# Altium project PLD.PrjPcb (part 1 of 2)
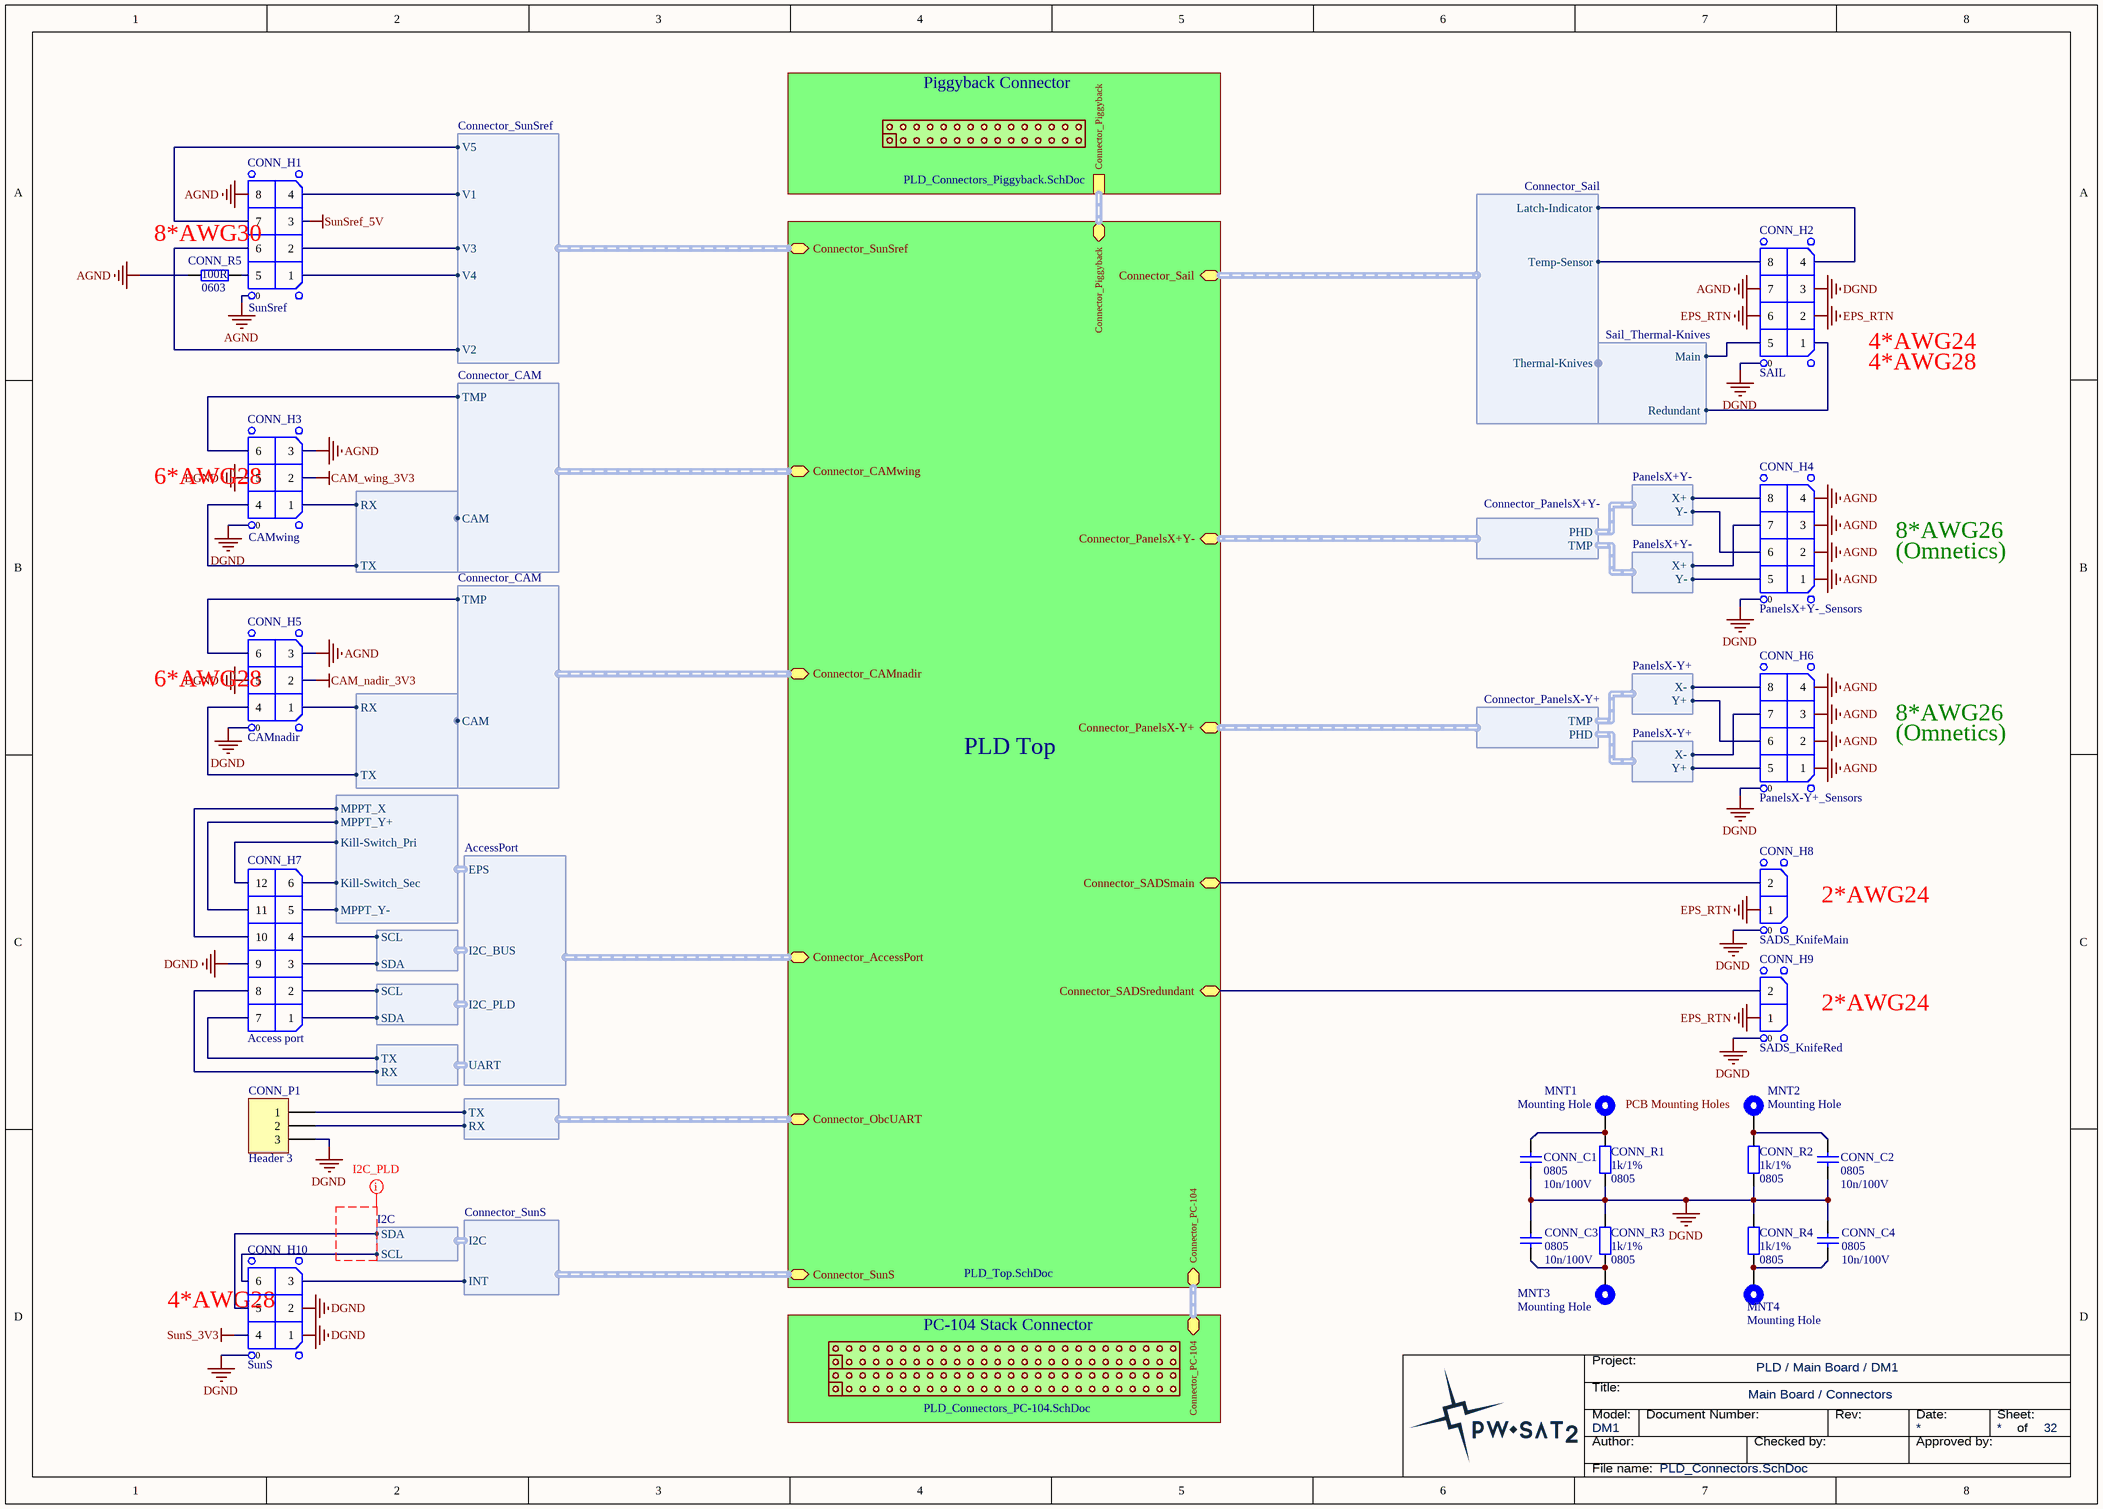
[diagram p0: PLD_Connectors.SchDoc]
ApprovedBy_Name: Piotr Kuligowski; Author_Name: Grzegorz Gajoch; CheckedBy_Name: Michal Gumiela; Equipment: Main Board; Model: DM1; PCB_Author: (pcbdoc author); PCB_CheckedBy: (not checked); PCB_DocName: Main Board; PCB_DocNo: PWSat2-xxx-DW-xxx; PCB_Id: Main Board; PCB_Revision: 1; Project_FullName: PW-Sat2; Project_Id: PLD; Project_ShortName: PLD; Schematics_DocName: Main Board; Schematics_DocNo: PWSat2-xxx-DW-xxx; Schematics_Revision: 1; Subsystem: PLD
22 sheets, 195 parts. Net scope: hierarchical (ports join the sheet entries above them; power ports are global).
Board file: PLD.PcbDoc
Sheets:
  PLD_Connectors.SchDoc
    PLD Top = PLD_Top.SchDoc
      RadFET = PLD_RadFET.SchDoc
        Radfet Supply = PLD_RadFET_Supply.SchDoc
          LCL 5V = PLD_RadFET_LCL.SchDoc
          LCL 3V3d = PLD_RadFET_LCL.SchDoc
        Current source = PLD_RadFET_Current_Source.SchDoc
        Channel selector = PLD_RadFET_Mux.SchDoc
        Filter = PLD_RadFET_Differential_Lowpass.SchDoc
      AVR interface = PLD_Sensors_AVR_Interface.SchDoc
        Watchdog = PLD_AVR_Watchdog.SchDoc
      UART-Buffer&MUX for CAMs = PLD_CAM_MUX.SchDoc
      SunS Ref. Interface = PLD_SunSref-Interface.SchDoc
      ADC = PLD_ADC.SchDoc
      Gyroscopes = PLD_Gyroscopes.SchDoc
      Flash Memory 3 = PLD_Flash-Memory.SchDoc
      8 CH PT1000 interface = PLD_Thermometers_PT1000.SchDoc
        PT1000 interface = PLD_Thermometers_PT1000_interface.SchDoc
      ADC MUX = PLD_ADC_MUX.SchDoc
      FRAM Memory 1 = PLD_FRAM-Memory.SchDoc
      AccessPortInterface = PLD_AcessPortInterface.SchDoc
      Flash Memory 2 = PLD_Flash-Memory.SchDoc
      Flash Memory 1 = PLD_Flash-Memory.SchDoc
      FRAM Memory 2 = PLD_FRAM-Memory.SchDoc
      FRAM Memory 3 = PLD_FRAM-Memory.SchDoc
    PC-104 Stack Connector = PLD_Connectors_PC-104.SchDoc
    Piggyback Connector = PLD_Connectors_Piggyback.SchDoc

## Sheet PLD_Connectors.SchDoc: Connectors
size A3; ApprovedBy: Piotr Kuligowski; CheckedBy: Michal Gumiela; Author: Grzegorz Gajoch; DocumentNumber: PWSat2-xxx-DW-xxx; Revision: 1; SheetTotal: 32; Model: DM1

### Parts
CONN_C1  Package: 0805  [SMD_Capacitor_0805]  (hidden comment: 10n/100V)
CONN_C2  Package: 0805  [SMD_Capacitor_0805]  (hidden comment: 10n/100V)
CONN_C3  Package: 0805  [SMD_Capacitor_0805]  (hidden comment: 10n/100V)
CONN_C4  Package: 0805  [SMD_Capacitor_0805]  (hidden comment: 10n/100V)
CONN_H1  SunSref  [Harwin_Datamate_L-Tek_M80-8670805]
CONN_H2  SAIL  [Harwin_Datamate_L-Tek_M80-8670805]
CONN_H3  CAMwing  [Harwin_Datamate_L-Tek_M80-8670605]
CONN_H4  PanelsX+Y-_Sensors  [Harwin_Datamate_L-Tek_M80-8670805]
CONN_H5  CAMnadir  [Harwin_Datamate_L-Tek_M80-8670605]
CONN_H6  PanelsX-Y+_Sensors  [Harwin_Datamate_L-Tek_M80-8670805]
CONN_H7  Access port  [Harwin_Datamate_L-Tek_M80-8411242_W/O_RETAINING_STRAP]
CONN_H8  SADS_KnifeMain  [Harwin_Datamate_L-Tek_M80-8770222]
CONN_H9  SADS_KnifeRed  [Harwin_Datamate_L-Tek_M80-8770222]
CONN_H10  SunS  [Harwin_Datamate_L-Tek_M80-8670605]
CONN_P1  Header 3  [HEADER 1X3 FEMALE]
CONN_R1  Package: 0805  [SMD_Resistor_0805]  (hidden comment: 1k/1%)
CONN_R2  Package: 0805  [SMD_Resistor_0805]  (hidden comment: 1k/1%)
CONN_R3  Package: 0805  [SMD_Resistor_0805]  (hidden comment: 1k/1%)
CONN_R4  Package: 0805  [SMD_Resistor_0805]  (hidden comment: 1k/1%)
CONN_R5  Package: 0603  [SMD_Resistor_0603]  (hidden comment: 100R)
MNT1  Mounting Hole  [PC-104_PcbMntHole_M3]
MNT2  Mounting Hole  [PC-104_PcbMntHole_M3]
MNT3  Mounting Hole  [PC-104_PcbMntHole_M3]
MNT4  Mounting Hole  [PC-104_PcbMntHole_M3]

### Sub-sheets
PC-104 Stack Connector = PLD_Connectors_PC-104.SchDoc: Connector_PC-104 (harness Connector_PC-104)
Piggyback Connector = PLD_Connectors_Piggyback.SchDoc: Connector_Piggyback (harness Connector_Piggyback)
PLD Top = PLD_Top.SchDoc: Connector_Sail (harness Connector_Sail), Connector_PC-104 (harness Connector_PC-104), Connector_Piggyback (harness Connector_Piggyback), Connector_CAMnadir (harness Connector_CAM), Connector_PanelsX-Y+ (harness Connector_PanelsX-Y+), Connector_PanelsX+Y- (harness Connector_PanelsX+Y-), Connector_SunS (harness Connector_SunS), Connector_CAMwing (harness Connector_CAM), Connector_SADSmain, Connector_SADSredundant, Connector_SunSref (harness Connector_SunSref), Connector_AccessPort (harness AccessPort), Connector_ObcUART (harness UART)

### Harnesses
Connector_Sail: Latch-Indicator, Temp-Sensor, Thermal-Knives
Sail_Thermal-Knives: Main, Redundant
Connector_SunS: I2C, INT
I2C: SDA, SCL
CAM: TX, RX
Connector_CAM: CAM, TMP
Connector_PanelsX-Y+: PHD, TMP
PanelsX-Y+: X-, Y+
Connector_PanelsX+Y-: TMP, PHD
PanelsX+Y-: X+, Y-
Connector_SunSref: V1, V2, V3, V4, V5
AccessPort: I2C_PLD, I2C_BUS, EPS, UART
EPS_ACCESSPORT: MPPT_X, MPPT_Y+, MPPT_Y-, Kill-Switch_Pri, Kill-Switch_Sec
UART: RX, TX

### Nets
AGND: CONN_H1.0 CONN_H1.8 CONN_H2.7 CONN_H3.3 CONN_H4.1 CONN_H4.2 CONN_H4.3 CONN_H4.4 CONN_H5.3 CONN_H6.1 CONN_H6.2 CONN_H6.3 CONN_H6.4 CONN_R5.1
CAM_nadir_3V3: CONN_H5.2
CAM_wing_3V3: CONN_H3.2
DGND: CONN_C1.1 CONN_C2.1 CONN_C3.2 CONN_C4.2 CONN_H2.0 CONN_H2.3 CONN_H3.0 CONN_H3.5 CONN_H4.0 CONN_H5.0 CONN_H5.5 CONN_H6.0 CONN_H7.9 CONN_H8.0 CONN_H9.0 CONN_H10.0 CONN_H10.1 CONN_H10.2 CONN_P1.3 CONN_R1.1 CONN_R2.1 CONN_R3.2 CONN_R4.2
EPS_RTN: CONN_H2.2 CONN_H2.6 CONN_H8.1 CONN_H9.1
SunS_3V3: CONN_H10.4
SunSref_5V: CONN_H1.3
PC-104_EPS_Kill-Switch_Pri: CONN_H7.12 ; harness EPS_ACCESSPORT.Kill-Switch_Pri
PC-104_EPS_Kill-Switch_Sec: CONN_H7.6 ; harness EPS_ACCESSPORT.Kill-Switch_Sec
PC-104_EPS_MPPT_X: CONN_H7.10 ; harness EPS_ACCESSPORT.MPPT_X
PC-104_EPS_MPPT_Y+: CONN_H7.11 ; harness EPS_ACCESSPORT.MPPT_Y+
PC-104_EPS_MPPT_Y-: CONN_H7.5 ; harness EPS_ACCESSPORT.MPPT_Y-
PC-104_LCL_SADSmain: CONN_H8.2 ; sheet PLD Top/Connector_SADSmain
PC-104_LCL_SADSred: CONN_H9.2 ; sheet PLD Top/Connector_SADSredundant
Piggyback_ADC_PD5: CONN_H10.3 ; sheet PLD Top/Connector_SunS.INT
NetAP_R1_1: CONN_P1.1 ; sheet PLD Top/Connector_ObcUART.TX
NetAP_R2_1: CONN_P1.2 ; sheet PLD Top/Connector_ObcUART.RX
NetAP_R3_1: CONN_H7.7 ; harness UART.TX
NetAP_R4_1: CONN_H7.8 ; harness UART.RX
NetAP_R5_1: CONN_H7.4 ; harness I2C.SCL
NetAP_R6_1: CONN_H7.3 ; harness I2C.SDA
NetAP_R7_1: CONN_H7.2 ; harness I2C.SCL
NetAP_R8_1: CONN_H7.1 ; harness I2C.SDA
NetCONN_C1_2: CONN_C1.2 CONN_R1.2 MNT1.1
NetCONN_C2_2: CONN_C2.2 CONN_R2.2 MNT2.1
NetCONN_C3_1: CONN_C3.1 CONN_R3.1 MNT3.1
NetCONN_C4_1: CONN_C4.1 CONN_R4.1 MNT4.1
NetCONN_H1_1: CONN_H1.1 ; sheet PLD Top/Connector_SunSref.V4
NetCONN_H1_2: CONN_H1.2 ; sheet PLD Top/Connector_SunSref.V3
NetCONN_H1_4: CONN_H1.4 ; sheet PLD Top/Connector_SunSref.V1
NetCONN_H1_5: CONN_H1.5 CONN_R5.2
NetCONN_H1_6: CONN_H1.6 ; sheet PLD Top/Connector_SunSref.V2
NetCONN_H1_7: CONN_H1.7 ; sheet PLD Top/Connector_SunSref.V5
NetCONN_H2_1: CONN_H2.1 ; harness Sail_Thermal-Knives.Redundant
NetCONN_H2_4: CONN_H2.4 ; sheet PLD Top/Connector_Sail.Latch-Indicator
NetCONN_H2_5: CONN_H2.5 ; harness Sail_Thermal-Knives.Main
NetCONN_H2_8: CONN_H2.8 ; sheet PLD Top/Connector_Sail.Temp-Sensor
NetCONN_H3_1: CONN_H3.1 ; harness CAM.RX
NetCONN_H3_4: CONN_H3.4 ; harness CAM.TX
NetCONN_H3_6: CONN_H3.6 ; sheet PLD Top/Connector_CAMwing.TMP
NetCONN_H4_5: CONN_H4.5 ; harness PanelsX+Y-.Y-
NetCONN_H4_6: CONN_H4.6 ; harness PanelsX+Y-.Y-
NetCONN_H4_7: CONN_H4.7 ; harness PanelsX+Y-.X+
NetCONN_H4_8: CONN_H4.8 ; harness PanelsX+Y-.X+
NetCONN_H5_1: CONN_H5.1 ; harness CAM.RX
NetCONN_H5_4: CONN_H5.4 ; harness CAM.TX
NetCONN_H5_6: CONN_H5.6 ; sheet PLD Top/Connector_CAMnadir.TMP
NetCONN_H6_5: CONN_H6.5 ; harness PanelsX-Y+.Y+
NetCONN_H6_6: CONN_H6.6 ; harness PanelsX-Y+.Y+
NetCONN_H6_7: CONN_H6.7 ; harness PanelsX-Y+.X-
NetCONN_H6_8: CONN_H6.8 ; harness PanelsX-Y+.X-
NetCONN_H10_5: CONN_H10.5 ; harness I2C.SDA
NetCONN_H10_6: CONN_H10.6 ; harness I2C.SCL

### Buses and harness runs
harness sheet PC-104 Stack Connector/Connector_PC-104 = sheet PLD Top/Connector_PC-104
harness sheet Piggyback Connector/Connector_Piggyback = sheet PLD Top/Connector_Piggyback

### Layout directives
net class I2C_PLD: (no net found under the mark)

### Notes on the sheet
- 8*AWG30
- 4*AWG24
- 4*AWG28
- 6*AWG28
- 8*AWG26
- (Omnetics)
- 2*AWG24
- PCB Mounting Holes
- Title:
- Project:
- Author:
- Model:
- Document Number:
- Checked by:
- Rev:
- Date:
- Approved by:
- Sheet:
- of
- File name:

### Library data of the parts
CONN_C1-CONN_C4 = Cer_C0805T104K1RCLTU: Ceramic Cap Kemet COTS 100n/100V X7R 0805; ManufacturerPartNumber: C0805T104K1RCLTU; Manufacturer: Kemet; Value: 10n/100V
CONN_H1 CONN_H2 CONN_H4 CONN_H6 = Harwin_Datamate_L-Tek_2x4pin: Harwin DataMate L-Tek, 2mm pitch, 2x4pin.; Value: Harwin DataMate L-Tek 2x4pin
CONN_H3 CONN_H5 CONN_H10 = Harwin_Datamate_L-Tek_2x3pin: Harwin DataMate L-Tek, 2mm pitch, 2x3pin.; Value: Harwin DataMate L-Tek 2x3pin
CONN_H7 = Harwin_Datamate_L-Tek_2x6pin_W/O_RETAINING_STRAP: Harwin DataMate L-Tek, 2mm pitch, 2x6pin.; Value: Harwin DataMate L-Tek 2x6pin
CONN_H8 CONN_H9 = Harwin_Datamate_L-Tek_1x2pin: Harwin DataMate L-Tek, 2mm pitch, 1x2pin.; Value: Harwin DataMate L-Tek 1x2pin
CONN_P1 = Header 3: Header, 3-Pin; LatestRevisionDate: 17-Jul-2002; LatestRevisionNote: Re-released for DXP Platform.; Publisher: Altium Limited
CONN_R1-CONN_R4 = CRCW08051K00FKxxxx: 1k/1% Vishay CRCW 0805 Resistor. 125mW, 100ppm, 150V.; Manufacturer: Vishay; ManufacturerPartNumber: CRCW08051K00FKxxxx; Value: 1k/1%
CONN_R5 = Res: Value: 100R
MNT1-MNT4 = MntHole: PCB Mounting Hole; Value: Mounting Hole

## Sheet PLD_Top.SchDoc: Top
size A2; ApprovedBy: Piotr Kuligowski; CheckedBy: Michal Gumiela; Author: Grzegorz Gajoch; DocumentNumber: PWSat2-xxx-DW-xxx; Revision: 1; SheetTotal: 32; Model: DM1
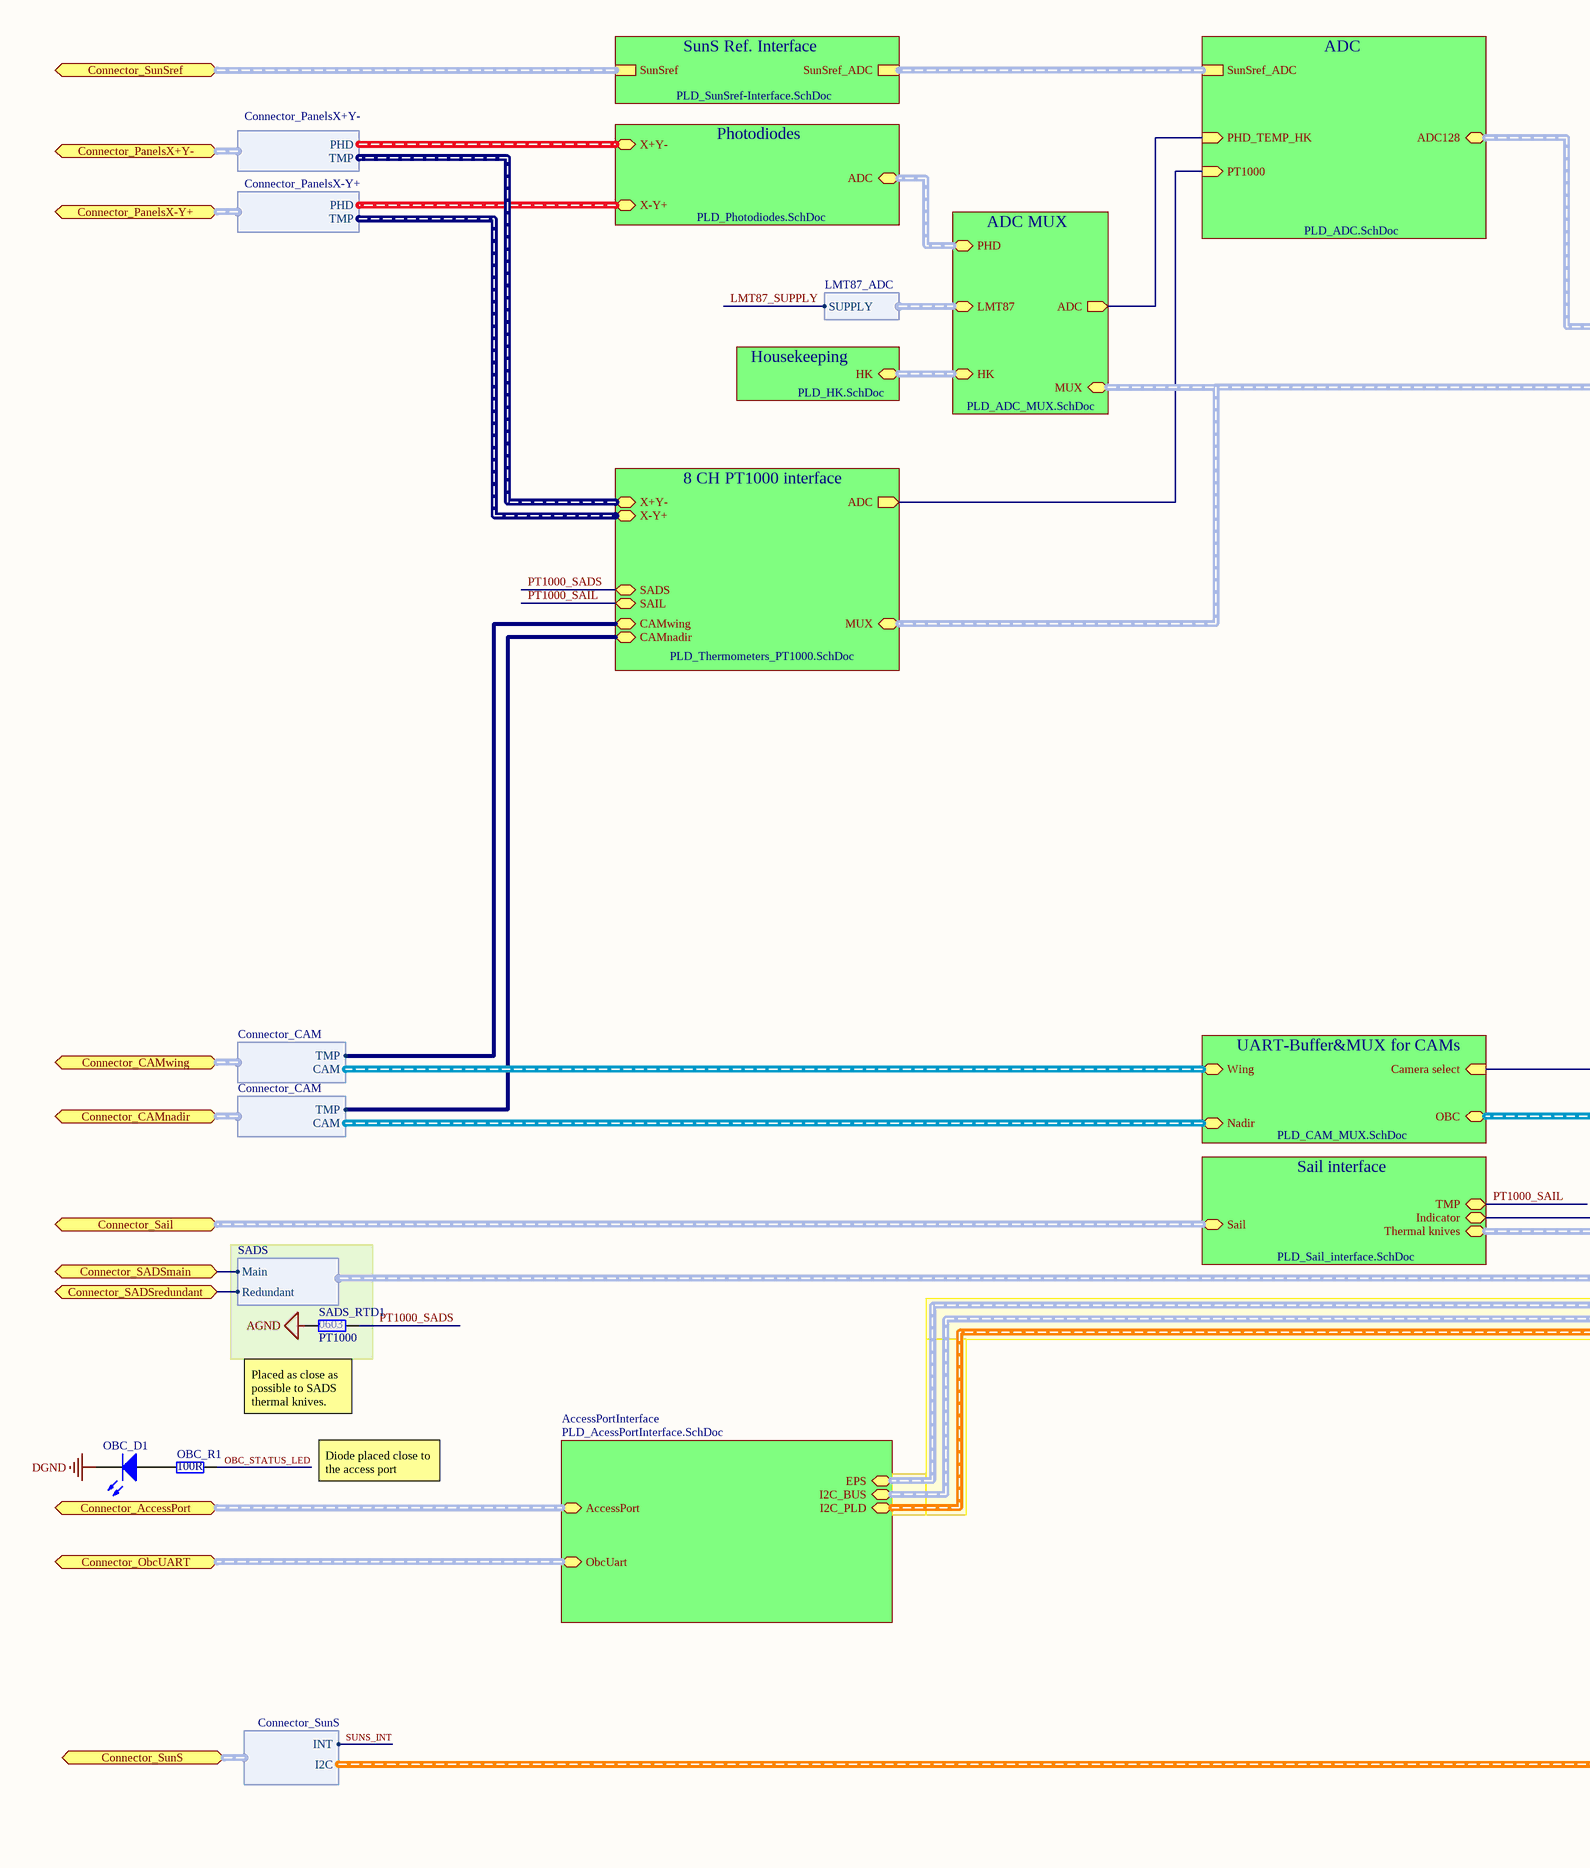
[diagram p1: PLD_Top.SchDoc, left]
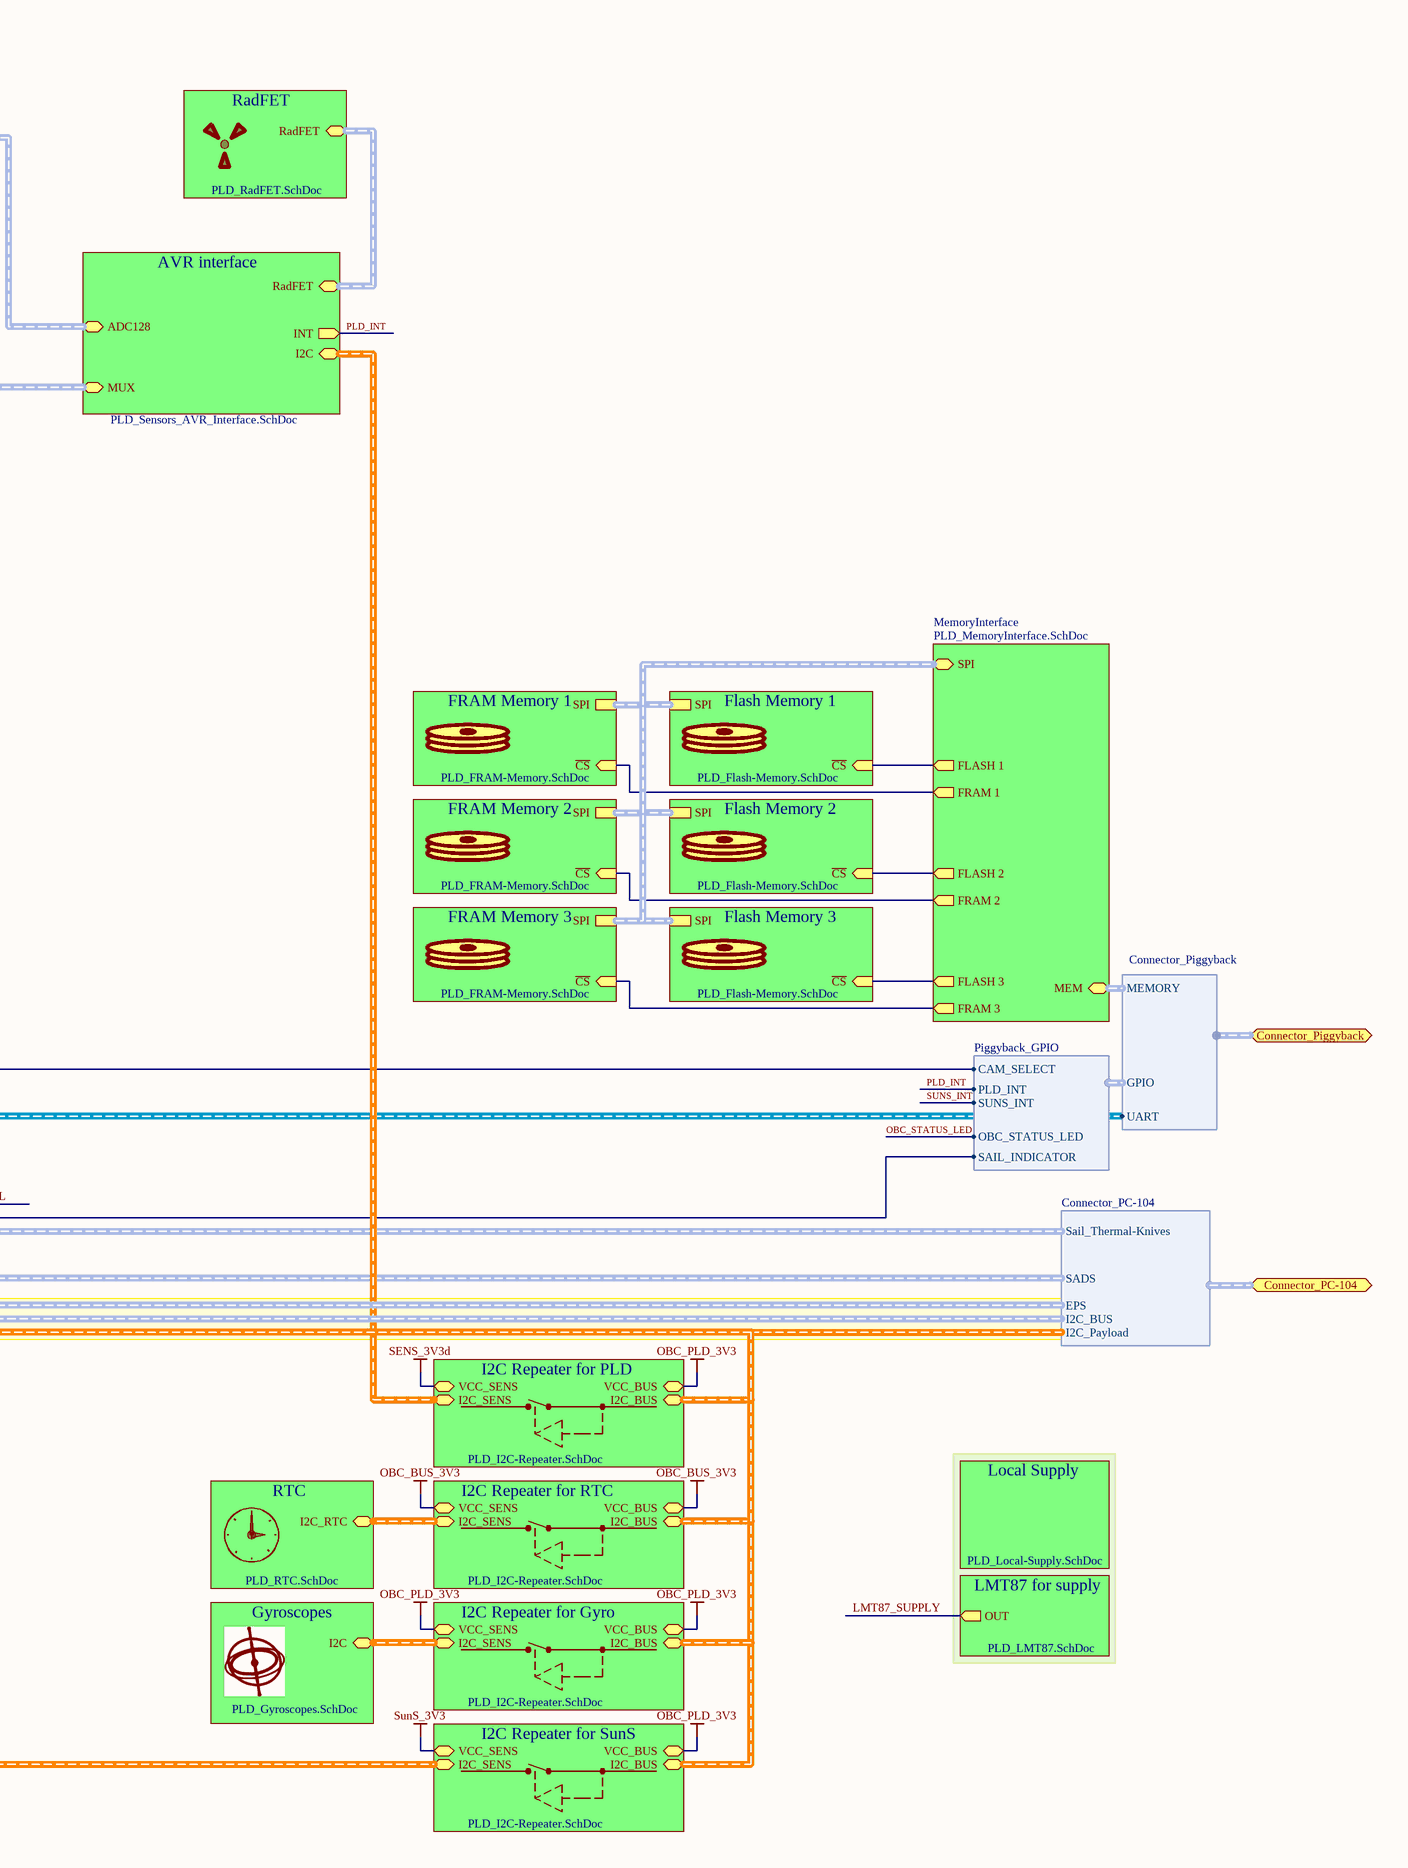
[diagram p2: PLD_Top.SchDoc, right]

### Parts
OBC_D1  LEDX  [LED 0805 Blue]  (value not drawn)
OBC_R1  100R  [SMD_Resistor_0603]
SADS_RTD1  Package: 0603  [SMD_Resistor_0603]  (hidden comment: PT1000)

### Sub-sheets
8 CH PT1000 interface = PLD_Thermometers_PT1000.SchDoc: MUX (harness MUX), ADC (out), CAMwing, CAMnadir, X-Y+ (harness PanelsX-Y+), X+Y- (harness PanelsX+Y-), SADS (bidir), SAIL (bidir)
AccessPortInterface = PLD_AcessPortInterface.SchDoc: AccessPort (harness AccessPort), ObcUart (harness UART), I2C_BUS (harness I2C), I2C_PLD (harness I2C), EPS (harness EPS_ACCESSPORT)
ADC = PLD_ADC.SchDoc: SunSref_ADC (harness SunSref_ADC), PHD_TEMP_HK (in), PT1000 (in), ADC128 (harness ADC128)
ADC MUX = PLD_ADC_MUX.SchDoc: LMT87 (harness LMT87_ADC), HK (harness HK_ADC), ADC (out), MUX (harness MUX), PHD (harness PHD_ADC)
AVR interface = PLD_Sensors_AVR_Interface.SchDoc: I2C (harness I2C), RadFET (harness RadFET), ADC128 (harness ADC128), MUX (harness MUX), INT (out)
Flash Memory 1 = PLD_Flash-Memory.SchDoc: SPI (harness SPI), ~{CS} (in)
Flash Memory 2 = PLD_Flash-Memory.SchDoc: SPI (harness SPI), ~{CS} (in)
Flash Memory 3 = PLD_Flash-Memory.SchDoc: SPI (harness SPI), ~{CS} (in)
FRAM Memory 1 = PLD_FRAM-Memory.SchDoc: SPI (harness SPI), ~{CS} (in)
FRAM Memory 2 = PLD_FRAM-Memory.SchDoc: SPI (harness SPI), ~{CS} (in)
FRAM Memory 3 = PLD_FRAM-Memory.SchDoc: SPI (harness SPI), ~{CS} (in)
Gyroscopes = PLD_Gyroscopes.SchDoc: I2C (harness I2C)
Housekeeping = PLD_HK.SchDoc (file not in this document): HK (harness HK_ADC)
I2C Repeater for Gyro = PLD_I2C-Repeater.SchDoc (file not in this document): I2C_BUS (harness I2C), VCC_SENS, VCC_BUS, I2C_SENS (harness I2C)
I2C Repeater for PLD = PLD_I2C-Repeater.SchDoc (file not in this document): I2C_BUS (harness I2C), VCC_SENS, VCC_BUS, I2C_SENS (harness I2C)
I2C Repeater for RTC = PLD_I2C-Repeater.SchDoc (file not in this document): I2C_BUS (harness I2C), VCC_SENS, VCC_BUS, I2C_SENS (harness I2C)
I2C Repeater for SunS = PLD_I2C-Repeater.SchDoc (file not in this document): I2C_BUS (harness I2C), VCC_SENS, VCC_BUS, I2C_SENS (harness I2C)
LMT87 for supply = PLD_LMT87.SchDoc (file not in this document): OUT (out)
Local Supply = PLD_Local-Supply.SchDoc (file not in this document): no entries
MemoryInterface = PLD_MemoryInterface.SchDoc (file not in this document): FLASH 1 (out), SPI (harness SPI), FRAM 1 (out), FLASH 2 (out), FLASH 3 (out), FRAM 2 (out), FRAM 3 (out), MEM (harness MEMORY)
Photodiodes = PLD_Photodiodes.SchDoc (file not in this document): X-Y+ (harness PanelsX-Y+), X+Y- (harness PanelsX+Y-), ADC (harness PHD_ADC)
RadFET = PLD_RadFET.SchDoc: RadFET (harness RadFET)
RTC = PLD_RTC.SchDoc (file not in this document): I2C_RTC (harness I2C)
Sail interface = PLD_Sail_interface.SchDoc (file not in this document): TMP (bidir), Indicator, Sail (harness Connector_Sail), Thermal knives (harness Sail_Thermal-Knives)
SunS Ref. Interface = PLD_SunSref-Interface.SchDoc: SunSref (harness Connector_SunSref), SunSref_ADC (harness SunSref_ADC)
UART-Buffer&MUX for CAMs = PLD_CAM_MUX.SchDoc: Camera select (in), OBC (harness UART), Wing (harness CAM), Nadir (harness CAM)

### Ports
Connector_AccessPort (harness AccessPort), Connector_CAMnadir (harness Connector_CAM), Connector_CAMwing (harness Connector_CAM), Connector_ObcUART (harness UART), Connector_PanelsX+Y- (harness Connector_PanelsX+Y-), Connector_PanelsX-Y+ (harness Connector_PanelsX-Y+), Connector_PC-104 (harness Connector_PC-104), Connector_Piggyback (harness Connector_Piggyback), Connector_SADSmain, Connector_SADSredundant, Connector_Sail (harness Connector_Sail), Connector_SunS (harness Connector_SunS), Connector_SunSref (harness Connector_SunSref)

### Harnesses
Connector_CAM: CAM, TMP
Connector_PanelsX+Y-: TMP, PHD
Connector_PanelsX-Y+: PHD, TMP
Connector_PC-104: I2C_Payload, Sail_Thermal-Knives, SADS, I2C_BUS, EPS
SADS: Main, Redundant
LMT87_ADC: SUPPLY
Connector_SunS: I2C, INT
Connector_Piggyback: UART, GPIO, MEMORY
Piggyback_GPIO: CAM_SELECT, PLD_INT, SAIL_INDICATOR, SUNS_INT, OBC_STATUS_LED

### Nets
AGND: SADS_RTD1.1
DGND: OBC_D1.2(K)
OBC_BUS_3V3: sheet I2C Repeater for RTC/VCC_SENS, sheet I2C Repeater for RTC/VCC_BUS
OBC_PLD_3V3: sheet I2C Repeater for PLD/VCC_BUS, sheet I2C Repeater for SunS/VCC_BUS, sheet I2C Repeater for Gyro/VCC_SENS, sheet I2C Repeater for Gyro/VCC_BUS
LMT87_SUPPLY: sheet LMT87 for supply/OUT, sheet ADC MUX/LMT87.SUPPLY
OBC_STATUS_LED: OBC_R1.2 ; harness Piggyback_GPIO.OBC_STATUS_LED
PC-104_LCL_SADSmain: port Connector_SADSmain, harness SADS.Main
PC-104_LCL_SADSred: port Connector_SADSredundant, harness SADS.Redundant
Piggyback_ADC_PD4: sheet Sail interface/Indicator, harness Piggyback_GPIO.SAIL_INDICATOR
Piggyback_GPIO_PB12: sheet UART-Buffer&MUX for CAMs/Camera select, harness Piggyback_GPIO.CAM_SELECT
PLD_INT: sheet AVR interface/INT, harness Piggyback_GPIO.PLD_INT  [project net INT]
PT1000_SADS: SADS_RTD1.2 ; sheet 8 CH PT1000 interface/SADS
PT1000_SAIL: sheet Sail interface/TMP, sheet 8 CH PT1000 interface/SAIL
SUNS_INT: port Connector_SunS.INT, harness Piggyback_GPIO.SUNS_INT  [project net Piggyback_ADC_PD5]
NetADC_C7_1: sheet ADC/PHD_TEMP_HK, sheet ADC MUX/ADC
NetADC_C8_1: sheet ADC/PT1000, sheet 8 CH PT1000 interface/ADC
NetCONN_H3_6: sheet 8 CH PT1000 interface/CAMwing, port Connector_CAMwing.TMP
NetCONN_H5_6: sheet 8 CH PT1000 interface/CAMnadir, port Connector_CAMnadir.TMP
NetFlash_U1_Flash_Memory_1_1: sheet Flash Memory 1/~{CS}, sheet MemoryInterface/FLASH 1
NetFlash_U1_Flash_Memory_2_1: sheet Flash Memory 2/~{CS}, sheet MemoryInterface/FLASH 2
NetFlash_U1_Flash_Memory_3_1: sheet Flash Memory 3/~{CS}, sheet MemoryInterface/FLASH 3
NetOBC_D1_1: OBC_D1.1(A) OBC_R1.1
NetU4_FRAM_Memory_1_1: sheet FRAM Memory 1/~{CS}, sheet MemoryInterface/FRAM 1
NetU4_FRAM_Memory_2_1: sheet FRAM Memory 2/~{CS}, sheet MemoryInterface/FRAM 2
NetU4_FRAM_Memory_3_1: sheet FRAM Memory 3/~{CS}, sheet MemoryInterface/FRAM 3

### Buses and harness runs
harness port Connector_AccessPort = sheet AccessPortInterface/AccessPort
harness port Connector_ObcUART = sheet AccessPortInterface/ObcUart
harness port Connector_Sail = sheet Sail interface/Sail
harness port Connector_SunSref = sheet SunS Ref. Interface/SunSref
harness sheet 8 CH PT1000 interface/MUX = sheet ADC MUX/MUX = sheet AVR interface/MUX
harness sheet AccessPortInterface/I2C_PLD = sheet I2C Repeater for Gyro/I2C_BUS = sheet I2C Repeater for PLD/I2C_BUS = sheet I2C Repeater for RTC/I2C_BUS = sheet I2C Repeater for SunS/I2C_BUS
harness sheet ADC MUX/HK = sheet Housekeeping/HK
harness sheet ADC MUX/PHD = sheet Photodiodes/ADC
harness sheet ADC/ADC128 = sheet AVR interface/ADC128
harness sheet ADC/SunSref_ADC = sheet SunS Ref. Interface/SunSref_ADC
harness sheet AVR interface/I2C = sheet I2C Repeater for PLD/I2C_SENS
harness sheet AVR interface/RadFET = sheet RadFET/RadFET
harness sheet Flash Memory 1/SPI = sheet Flash Memory 2/SPI = sheet Flash Memory 3/SPI = sheet FRAM Memory 1/SPI = sheet FRAM Memory 2/SPI = sheet FRAM Memory 3/SPI = sheet MemoryInterface/SPI
harness sheet Gyroscopes/I2C = sheet I2C Repeater for Gyro/I2C_SENS
harness sheet I2C Repeater for RTC/I2C_SENS = sheet RTC/I2C_RTC

### Notes on the sheet
- (near SADS_RTD1) Placed as close as possible to SADS thermal knives.
- Diode placed close to the access port
- Title:
- Project:
- Author:
- Model:
- File name:
- Document Number:
- Checked by:
- Rev:
- Date:
- Approved by:
- Sheet:
- of

### Library data of the parts
OBC_D1 = LEDX: Typical LED
OBC_R1 = Res: Value: 100R; Package: 0603
SADS_RTD1 = PTS060301B100RP100: PT1000 Vishay PTS060301B100RP100; Manufacturer: Vishay; ManufacturerPartNumber: PTS060301B100RP100; Value: PT1000

## Sheet PLD_RadFET.SchDoc: RadFET
size A4; ApprovedBy: Piotr Kuligowski; CheckedBy: Michal Gumiela; Author: Grzegorz Gajoch; DocumentNumber: PWSat2-xxx-DW-xxx; Revision: 1; SheetTotal: 32; Model: DM1
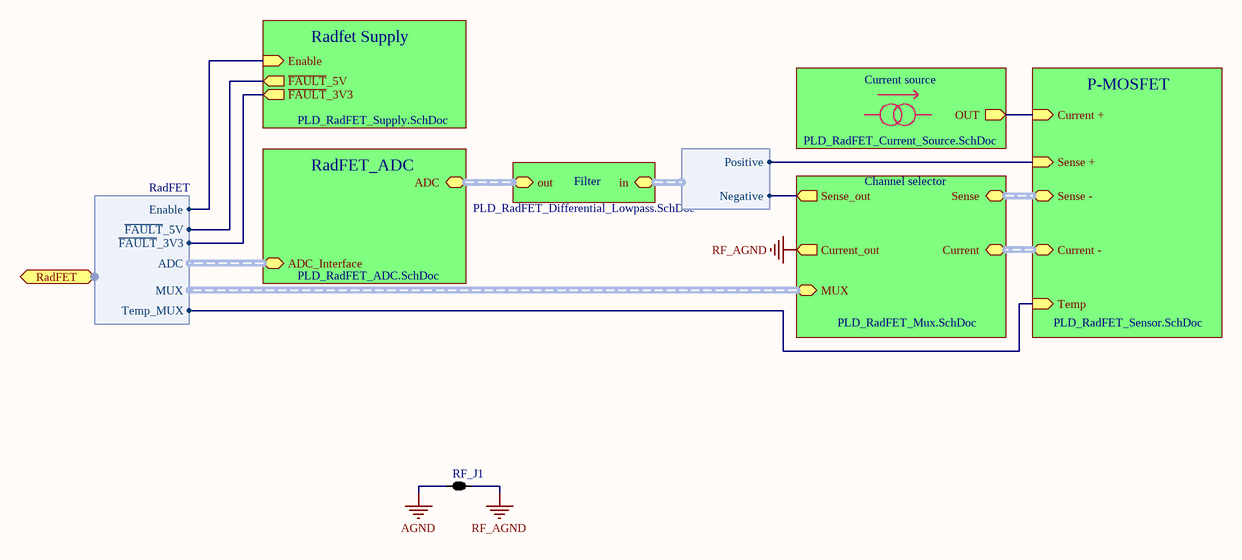
[diagram p3: PLD_RadFET.SchDoc]

### Parts
RF_J1  2 way net tie junction  [2way_LP]  (value not drawn)  (net tie, no BOM)

### Sub-sheets
Channel selector = PLD_RadFET_Mux.SchDoc: Sense_out (out), Sense (harness ADG709_MUX_CH), Current (harness ADG709_MUX_CH), MUX (harness ADG709_MUX), Current_out (out)
Current source = PLD_RadFET_Current_Source.SchDoc: OUT (out)
Filter = PLD_RadFET_Differential_Lowpass.SchDoc: in (harness ADC Channel), out (harness ADC Channel)
P-MOSFET = PLD_RadFET_Sensor.SchDoc (file not in this document): Sense + (in), Current + (in), Current - (harness ADG709_MUX_CH), Sense - (harness ADG709_MUX_CH), Temp (in)
Radfet Supply = PLD_RadFET_Supply.SchDoc: Enable (in), ~{FAULT}_5V (out), ~{FAULT}_3V3 (out)
RadFET_ADC = PLD_RadFET_ADC.SchDoc (file not in this document): ADC (harness ADC Channel), ADC_Interface (harness ADC_DIGITAL)

### Ports
RadFET (harness RadFET)

### Harnesses
RadFET: ADC, MUX, Enable, Temp_MUX, ~{FAULT}_5V, ~{FAULT}_3V3
ADC Channel: Positive, Negative

### Nets
AGND: RF_J1.1
RF_AGND: RF_J1.2 ; sheet Channel selector/Current_out
RadFET_EN: sheet Radfet Supply/Enable, port RadFET.Enable
RadFET_Temp_MUX: sheet P-MOSFET/Temp, port RadFET.Temp_MUX
NetMCU_R16_2: sheet Radfet Supply/~{FAULT}_5V, port RadFET.~{FAULT}_5V
NetMCU_R17_2: sheet Radfet Supply/~{FAULT}_3V3, port RadFET.~{FAULT}_3V3
NetRF_R5_2: sheet Current source/OUT, sheet P-MOSFET/Current +
NetRF_R14_1: sheet P-MOSFET/Sense +, sheet Filter/in.Positive
NetRF_R15_1: sheet Channel selector/Sense_out, sheet Filter/in.Negative

### Buses and harness runs
harness sheet Channel selector/Current = sheet P-MOSFET/Current -
harness sheet Channel selector/Sense = sheet P-MOSFET/Sense -
harness sheet Filter/out = sheet RadFET_ADC/ADC

### Notes on the sheet
- Title:
- Project:
- Author:
- Model:
- Document Number:
- Checked by:
- Rev:
- Date:
- Approved by:
- Sheet:
- of
- File name:

### Library data of the parts
RF_J1 = 2way: ComponentLink1URL: http://www.edatools.cz/addons; ComponentLink1Description: Source; FootprintNote: LP=12mil, MP=40mil, HP=120mil

## Sheet PLD_RadFET_Supply.SchDoc: Local Supply
size A3; ApprovedBy: Piotr Kuligowski; CheckedBy: Michal Gumiela; Author: Grzegorz Gajoch; DocumentNumber: PWSat2-xxx-DW-xxx; Revision: 1; SheetTotal: 32; Model: DM1
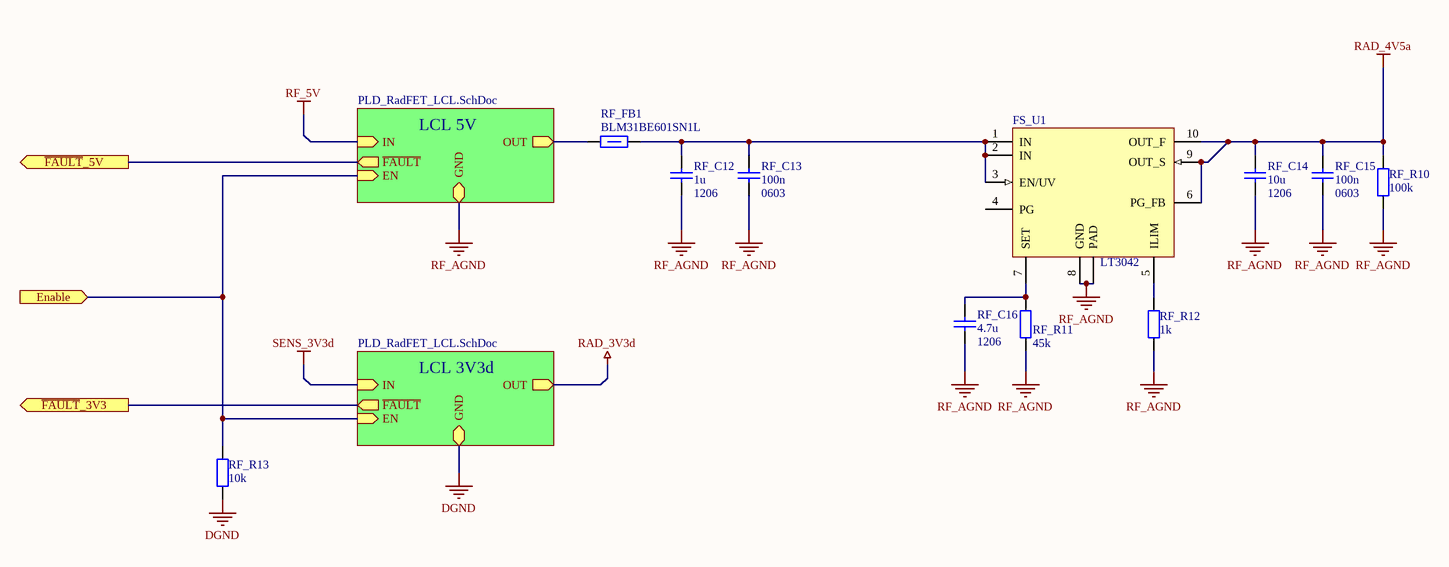
[diagram p4: PLD_RadFET_Supply.SchDoc]

### Parts
FS_U1  LT3042  [MSOP-10-M-thermal-pad]
RF_C12  value 1u  Package: 1206  [SMD_Capacitor_1206]  (hidden comment: Cap)
RF_C13  value 100n  Package: 0603  [SMD_Capacitor_0603]  (hidden comment: Cap)
RF_C14  value 10u  Package: 1206  [SMD_Capacitor_1206]  (hidden comment: Cap)
RF_C15  value 100n  Package: 0603  [SMD_Capacitor_0603]  (hidden comment: Cap)
RF_C16  value 4.7u  Package: 1206  [SMD_Capacitor_1206]  (hidden comment: Cap)
RF_FB1  ManufacturerPartNumber: BLM31BE601SN1L  [1206]  (hidden comment: 600R/100MHz)
RF_R10  100k  [SMD_Resistor_0603]
RF_R11  45k  [SMD_Resistor_0603]
RF_R12  1k  [SMD_Resistor_0603]
RF_R13  10k  [SMD_Resistor_0603]

### Sub-sheets
LCL 3V3d = PLD_RadFET_LCL.SchDoc: GND, IN (in), EN (in), OUT (out), ~{FAULT} (out)
LCL 5V = PLD_RadFET_LCL.SchDoc: GND, IN (in), EN (in), OUT (out), ~{FAULT} (out)

### Ports
Enable (in), ~{FAULT}_3V3 (out), ~{FAULT}_5V (out)

### Nets
DGND: RF_R13.1 ; sheet LCL 3V3d/GND
RAD_4V5a: FS_U1.6(PG_FB) FS_U1.9(OUT_S) FS_U1.10(OUT_F) RF_C14.1 RF_C15.1 RF_R10.2
RF_AGND: FS_U1.8(GND) FS_U1.11(PAD) RF_C12.2 RF_C13.2 RF_C14.2 RF_C15.2 RF_C16.2 RF_R10.1 RF_R11.1 RF_R12.1 ; sheet LCL 5V/GND
RadFET_EN: RF_R13.2 ; port Enable, sheet LCL 5V/EN, sheet LCL 3V3d/EN
NetFS_U1_1: FS_U1.1(IN) FS_U1.2(IN) FS_U1.3(EN/UV) RF_C12.1 RF_C13.1 RF_FB1.1
NetFS_U1_5: FS_U1.5(ILIM) RF_R12.2
NetFS_U1_7: FS_U1.7(SET) RF_C16.1 RF_R11.2
NetMCU_R16_2: port ~{FAULT}_5V, sheet LCL 5V/~{FAULT}
NetMCU_R17_2: port ~{FAULT}_3V3, sheet LCL 3V3d/~{FAULT}
NetRF_FB1_2: RF_FB1.2 ; sheet LCL 5V/OUT

Not connected (* = marked no-connect by the designer): FS_U1 4(PG)

### Notes on the sheet
- Title:
- Project:
- Author:
- Model:
- Document Number:
- Checked by:
- Rev:
- Date:
- Approved by:
- Sheet:
- of
- File name:

### Library data of the parts
FS_U1 = LT3042: 20V, 200mA, Ultralow Noise, Ultrahigh PSRR RF Linear Regulator; PartNumber: LT3042; ComponentLink1Description: Manufacturer URL; ComponentLink1URL: http://www.linear.com/; ComponentLink2Description: Datasheet; ComponentLink2URL: http://cds.linear.com/docs/en/datasheet/3042fa.pdf
RF_FB1 = FerriteBead: Ferrite Bead; Manufacturer: Murata; HelpUrl: http://www.mouser.com/ds/2/281/c31e-794748.pdf; Supplier 1: Mouser; Value: 600R/100MHz; Mouser: 81-BLM31B601S
RF_R10-RF_R13 = Res: Package: 0603
  RF_R10: Value: 100k
  RF_R11: Value: 45k
  RF_R12: Value: 1k
  RF_R13: Value: 10k

## Sheet PLD_RadFET_LCL.SchDoc: Local Supply
size A4; ApprovedBy: Piotr Kuligowski; CheckedBy: Michal Gumiela; Author: Grzegorz Gajoch; DocumentNumber: PWSat2-xxx-DW-xxx; Revision: 1; SheetTotal: 32; Model: DM1
Used 2 times, as channels PLD Top/RadFET/Radfet Supply/LCL 5V, PLD Top/RadFET/Radfet Supply/LCL 3V3d. Parts and nets are listed once, with the designators drawn on the sheet.
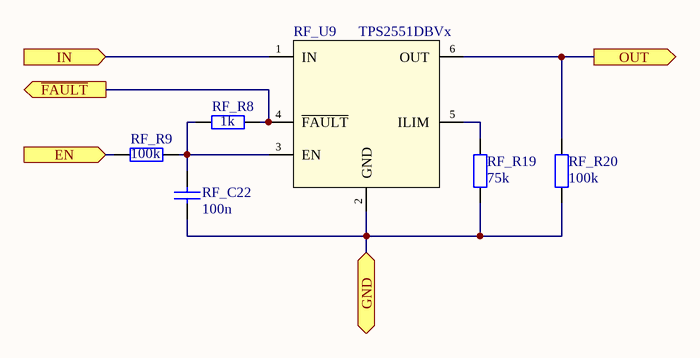
[diagram p5: PLD_RadFET_LCL.SchDoc]

### Parts
RF_C22  value 100n  [SMD_Capacitor_0603]  (hidden comment: Cap)
RF_R8  1k  [SMD_Resistor_0603]
RF_R9  100k  [SMD_Resistor_0603]
RF_R19  75k  [SMD_Resistor_0603]
RF_R20  100k  [SMD_Resistor_0603]
RF_U9  TPS2551DBVx  [SOT23-6]

### Ports
EN (in), GND, IN (in), OUT (out), ~{FAULT} (out)

### Nets
EN: RF_R9.2 ; port EN
~{FAULT}: RF_R8.1 RF_U9.4(~{FAULT}) ; port ~{FAULT}
GND: RF_C22.2 RF_R19.1 RF_R20.1 RF_U9.2(GND) ; port GND
IN: RF_U9.1(IN) ; port IN
OUT: RF_R20.2 RF_U9.6(OUT) ; port OUT
NetRF_C22_1: RF_C22.1 RF_R8.2 RF_R9.1 RF_U9.3(EN)
NetRF_R19_2: RF_R19.2 RF_U9.5(ILIM)

### Channels
PLD Top/RadFET/Radfet Supply/LCL 5V: designators end in _LCL_5V; ports EN=RadFET_EN GND=RF_AGND IN=RF_5V OUT=NetRF_FB1_2 ~{FAULT}=NetMCU_R16_2
PLD Top/RadFET/Radfet Supply/LCL 3V3d: designators end in _LCL_3V3d; ports EN=RadFET_EN GND=DGND IN=SENS_3V3d OUT=RAD_3V3d ~{FAULT}=NetMCU_R17_2

### Notes on the sheet
- Title:
- Project:
- Author:
- Model:
- Document Number:
- Checked by:
- Rev:
- Date:
- Approved by:
- Sheet:
- of
- File name:

### Library data of the parts
RF_R8 RF_R9 RF_R19 RF_R20 = Res: Package: 0603
  RF_R8: Value: 1k
  RF_R9 RF_R20: Value: 100k
  RF_R19: Value: 75k
RF_U9 = TPS2551DBVx: Adjustable Current-Limited Power-Distribution Switch.; Manufacturer: Texas Instruments; Value: TPS2551DBVx
RF_C22 = Cap: Package: 0603

## Sheet PLD_RadFET_Current_Source.SchDoc: Voltage adjustable current source
size A4; ApprovedBy: Piotr Kuligowski; CheckedBy: Michal Gumiela; Author: Grzegorz Gajoch; DocumentNumber: PWSat2-xxx-DW-xxx; Revision: 1; SheetTotal: 32; Model: DM1
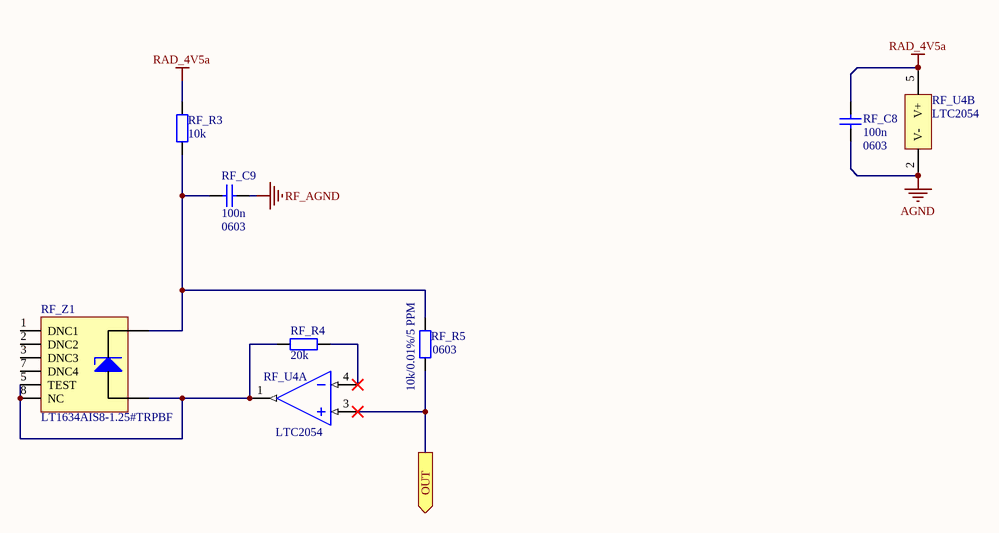
[diagram p6: PLD_RadFET_Current_Source.SchDoc]

### Parts
RF_C8  value 100n  Package: 0603  [SMD_Capacitor_0603]  (hidden comment: Cap)
RF_C9  value 100n  Package: 0603  [SMD_Capacitor_0603]  (hidden comment: Cap)
RF_R3  10k  [SMD_Resistor_0603]
RF_R4  20k  [SMD_Resistor_0603]
RF_R5  Package: 0603  [SMD_Resistor_0603]  (hidden comment: 10k/0.01%/5 PPM)
RF_U4  LTC2054  [SOT23-5]  (parts A,B of 2)
RF_Z1  1.25V  [SOIC-8-N]  (value not drawn)

### Ports
OUT (out)

### Nets
AGND: RF_C8.2 RF_U4.2(V-)
RAD_4V5a: RF_C8.1 RF_R3.1 RF_U4.5(V+)
RF_AGND: RF_C9.1
NetRF_C9_2: RF_C9.2 RF_R3.2 RF_R5.1 RF_Z1.6(K)
NetRF_R4_1: RF_R4.1 RF_U4.1(OUT_A) RF_Z1.4(A) RF_Z1.5(TEST) RF_Z1.8(NC)
NetRF_R4_2: RF_R4.2 RF_U4.4(IN-_A)
NetRF_R5_2: RF_R5.2 RF_U4.3(IN+_A) ; port OUT

Not connected (* = marked no-connect by the designer): RF_Z1 1(DNC1) 2(DNC2) 3(DNC3) 7(DNC4)

### Notes on the sheet
- Title:
- Project:
- Author:
- Model:
- Document Number:
- Checked by:
- Rev:
- Date:
- Approved by:
- Sheet:
- of
- File name:

### Library data of the parts
RF_R3-RF_R5 = Res
  RF_R3: Value: 10k; Package: 0603
  RF_R4: Value: 20k; Package: 0603
  RF_R5: Value: 10k/0.01%/5 PPM
RF_U4 = LTC2054: Single/Dual Micropower  Zero-Drift Operational Amplifi ers; Manufacturer: Linear Technology; Value: LTC2054
RF_Z1 = LT1634AIS8-1.25#TRPBF: Micropower Precision  Shunt Voltage Reference; Manufacturer: Linear; Value: 1.25V; ManufacturerPartNumber: LT1634AIS8-1.25#TRPBF

## Sheet PLD_RadFET_Mux.SchDoc: A 24-bit AD7714YRZ Analog-to-Digital Converter
size A4; ApprovedBy: Piotr Kuligowski; CheckedBy: Michal Gumiela; Author: Grzegorz Gajoch; DocumentNumber: PWSat2-xxx-DW-xxx; Revision: 1; SheetTotal: 32; Model: DM1
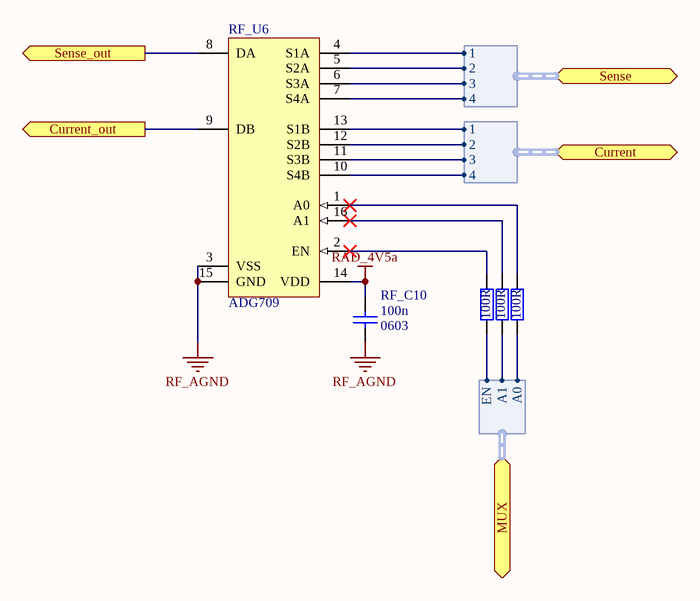
[diagram p7: PLD_RadFET_Mux.SchDoc]

### Parts
RF_C10  value 100n  Package: 0603  [SMD_Capacitor_0603]  (hidden comment: Cap)
RF_R6  100R  [SMD_Resistor_0603]
RF_R23  100R  [SMD_Resistor_0603]
RF_R24  100R  [SMD_Resistor_0603]
RF_U6  ADG709  [TSSOP16]

### Ports
Current (harness ADG709_MUX_CH), Current_out (out), MUX (harness ADG709_MUX), Sense (harness ADG709_MUX_CH), Sense_out (out)

### Harnesses
ADG709_MUX: A0, A1, EN
ADG709_MUX_CH: 1, 2, 3, 4
ADG709_MUX_CH: 2, 3, 4, 1

### Nets
RAD_4V5a: RF_C10.1 RF_U6.14(VDD)
RF_AGND: RF_C10.2 RF_U6.3(VSS) RF_U6.9(DB) RF_U6.15(GND) ; port Current_out
RadFET_MUX_A0: RF_R24.1 ; port MUX.A0
RadFET_MUX_A1: RF_R6.1 ; port MUX.A1
RadFET_MUX_EN: RF_R23.1 ; port MUX.EN
NetRF_R6_2: RF_R6.2 RF_U6.16(A1)
NetRF_R15_1: RF_U6.8(DA) ; port Sense_out
NetRF_R23_2: RF_R23.2 RF_U6.2(EN)
NetRF_R24_2: RF_R24.2 RF_U6.1(A0)
NetRF_U6_4: RF_U6.4(S1A) ; port Sense.1
NetRF_U6_5: RF_U6.5(S2A) ; port Sense.2
NetRF_U6_6: RF_U6.6(S3A) ; port Sense.3
NetRF_U6_7: RF_U6.7(S4A) ; port Sense.4
NetRF_U6_10: RF_U6.10(S4B) ; port Current.4
NetRF_U6_11: RF_U6.11(S3B) ; port Current.3
NetRF_U6_12: RF_U6.12(S2B) ; port Current.2
NetRF_U6_13: RF_U6.13(S1B) ; port Current.1

### Notes on the sheet
- Title:
- Project:
- Author:
- Model:
- Document Number:
- Checked by:
- Rev:
- Date:
- Approved by:
- Sheet:
- of
- File name:

### Library data of the parts
RF_R6 RF_R23 RF_R24 = Res: Value: 100R; Package: 0603
RF_U6 = ADG709: CMOS Analog 4-Channel Multiplexer; Manufacturer: Analog Devices; ManufacturerPartNumber: ADG709

## Sheet PLD_RadFET_Differential_Lowpass.SchDoc: Differential low-pass filter
size A4; ApprovedBy: Piotr Kuligowski; CheckedBy: Michal Gumiela; Author: Grzegorz Gajoch; DocumentNumber: PWSat2-xxx-DW-xxx; Revision: 1; SheetTotal: 32; Model: DM1
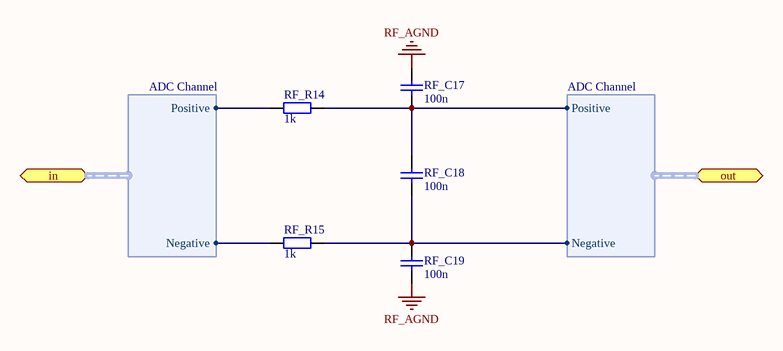
[diagram p8: PLD_RadFET_Differential_Lowpass.SchDoc]

### Parts
RF_C17  value 100n  [SMD_Capacitor_0603]  (hidden comment: Cap)
RF_C18  value 100n  [SMD_Capacitor_0603]  (hidden comment: Cap)
RF_C19  value 100n  [SMD_Capacitor_0603]  (hidden comment: Cap)
RF_R14  1k  [SMD_Resistor_0603]
RF_R15  1k  [SMD_Resistor_0603]

### Ports
in (harness ADC Channel), out (harness ADC Channel)

### Harnesses
ADC Channel: Positive, Negative

### Nets
RF_AGND: RF_C17.1 RF_C19.2
NetRF_C17_2: RF_C17.2 RF_C18.1 RF_R14.2 ; port out.Positive
NetRF_C18_2: RF_C18.2 RF_C19.1 RF_R15.2 ; port out.Negative
NetRF_R14_1: RF_R14.1 ; port in.Positive
NetRF_R15_1: RF_R15.1 ; port in.Negative

### Notes on the sheet
- Title:
- Project:
- Author:
- Model:
- Document Number:
- Checked by:
- Rev:
- Date:
- Approved by:
- Sheet:
- of
- File name:

### Library data of the parts
RF_R14 RF_R15 = Res: Value: 1k; Package: 0603
RF_C17-RF_C19 = Cap: Package: 0603

## Sheet PLD_Sensors_AVR_Interface.SchDoc: Gyroscopes Buffer
size A3; ApprovedBy: Piotr Kuligowski; CheckedBy: Michal Gumiela; Author: Grzegorz Gajoch; DocumentNumber: PWSat2-xxx-DW-xxx; Revision: 1; SheetTotal: 32; Model: DM1
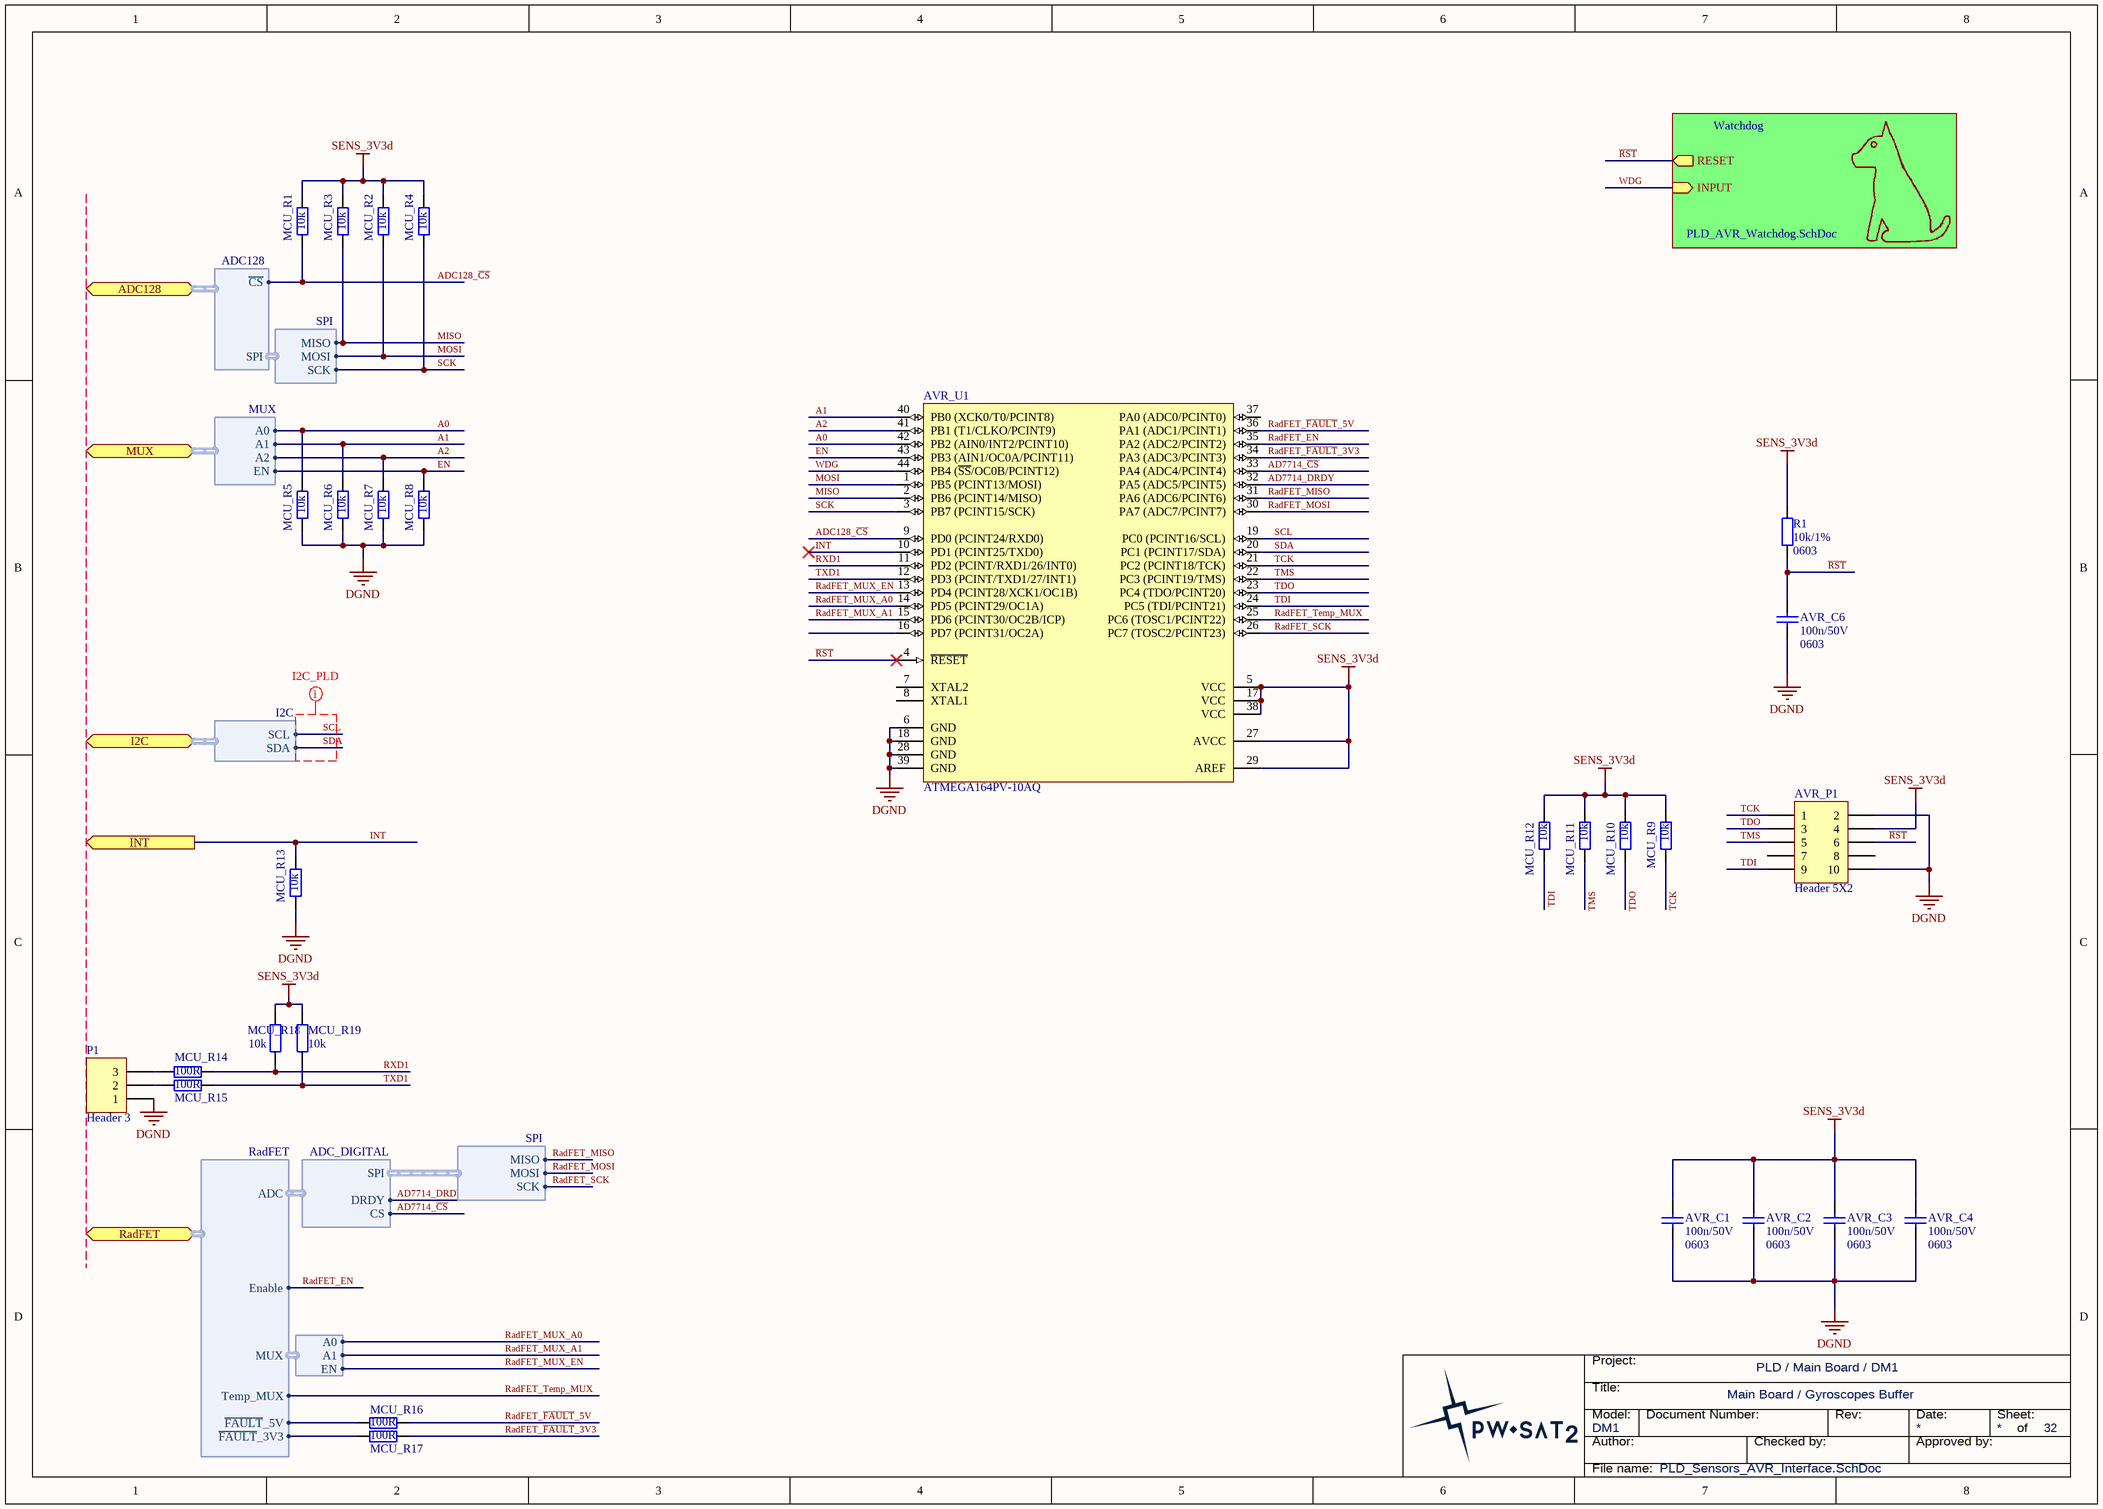
[diagram p9: PLD_Sensors_AVR_Interface.SchDoc]

### Parts
AVR_C1  Package: 0603  [SMD_Capacitor_0603]  (hidden comment: 100n/50V)
AVR_C2  Package: 0603  [SMD_Capacitor_0603]  (hidden comment: 100n/50V)
AVR_C3  Package: 0603  [SMD_Capacitor_0603]  (hidden comment: 100n/50V)
AVR_C4  Package: 0603  [SMD_Capacitor_0603]  (hidden comment: 100n/50V)
AVR_C6  Package: 0603  [SMD_Capacitor_0603]  (hidden comment: 100n/50V)
AVR_P1  Header 5X2  [HDR2X5]
AVR_U1  ATMEGA164PV-10AQ  [TQFP-44]
MCU_R1  10k  [SMD_Resistor_0603]
MCU_R2  10k  [SMD_Resistor_0603]
MCU_R3  10k  [SMD_Resistor_0603]
MCU_R4  10k  [SMD_Resistor_0603]
MCU_R5  10k  [SMD_Resistor_0603]
MCU_R6  10k  [SMD_Resistor_0603]
MCU_R7  10k  [SMD_Resistor_0603]
MCU_R8  10k  [SMD_Resistor_0603]
MCU_R9  10k  [SMD_Resistor_0603]
MCU_R10  10k  [SMD_Resistor_0603]
MCU_R11  10k  [SMD_Resistor_0603]
MCU_R12  10k  [SMD_Resistor_0603]
MCU_R13  10k  [SMD_Resistor_0603]
MCU_R14  100R  [SMD_Resistor_0603]
MCU_R15  100R  [SMD_Resistor_0603]
MCU_R16  100R  [SMD_Resistor_0603]
MCU_R17  100R  [SMD_Resistor_0603]
MCU_R18  10k  [SMD_Resistor_0603]
MCU_R19  10k  [SMD_Resistor_0603]
P1  Header 3  [HEADER1X3H Male]
R1  Package: 0603  [SMD_Resistor_0603]  (hidden comment: 10k/1%)

### Sub-sheets
Watchdog = PLD_AVR_Watchdog.SchDoc: RESET (out), INPUT (in)

### Ports
ADC128 (harness ADC128), I2C (harness I2C), INT (out), MUX (harness MUX), RadFET (harness RadFET)

### Harnesses
I2C: SDA, SCL
SPI: MISO, MOSI, SCK
ADC128: SPI, ~{CS}
MUX: A0, A1, A2, EN
ADC_DIGITAL: DRDY, CS, SPI
ADG709_MUX: A0, A1, EN
RadFET: ADC, MUX, Enable, Temp_MUX, ~{FAULT}_5V, ~{FAULT}_3V3

### Nets
DGND: AVR_C1.2 AVR_C2.2 AVR_C3.2 AVR_C4.2 AVR_C6.2 AVR_P1.2 AVR_P1.10 AVR_U1.6(GND) AVR_U1.18(GND) AVR_U1.28(GND) AVR_U1.39(GND) MCU_R5.1 MCU_R6.1 MCU_R7.1 MCU_R8.1 MCU_R13.2 P1.1
SENS_3V3d: AVR_C1.1 AVR_C2.1 AVR_C3.1 AVR_C4.1 AVR_P1.4 AVR_U1.5(VCC) AVR_U1.17(VCC) AVR_U1.27(AVCC) AVR_U1.29(AREF) AVR_U1.38(VCC) MCU_R1.1 MCU_R2.1 MCU_R3.1 MCU_R4.1 MCU_R9.1 MCU_R10.1 MCU_R11.1 MCU_R12.1 MCU_R18.1 MCU_R19.1 R1.1
A0: AVR_U1.42(PB2_(AIN0/INT2/PCINT10)) MCU_R5.2 ; port MUX.A0
A1: AVR_U1.40(PB0_(XCK0/T0/PCINT8)) MCU_R6.2 ; port MUX.A1
A2: AVR_U1.41(PB1_(T1/CLKO/PCINT9)) MCU_R7.2 ; port MUX.A2
AD7714_~{CS}: AVR_U1.33(PA4_(ADC4/PCINT4)) ; harness ADC_DIGITAL.CS
AD7714_DRDY: AVR_U1.32(PA5_(ADC5/PCINT5)) ; harness ADC_DIGITAL.DRDY
ADC128_~{CS}: AVR_U1.9(PD0_(PCINT24/RXD0)) MCU_R1.2 ; port ADC128.~{CS}
EN: AVR_U1.43(PB3_(AIN1/OC0A/PCINT11)) MCU_R8.2 ; port MUX.EN
INT: AVR_U1.10(PD1_(PCINT25/TXD0)) MCU_R13.1 ; port INT
MISO: AVR_U1.2(PB6_(PCINT14/MISO)) MCU_R3.2 ; harness SPI.MISO
MOSI: AVR_U1.1(PB5_(PCINT13/MOSI)) MCU_R2.2 ; harness SPI.MOSI
~{RST}: AVR_C6.1 AVR_P1.6 AVR_U1.4(~{RESET}) R1.2 ; sheet Watchdog/RESET
RadFET_EN: AVR_U1.35(PA2_(ADC2/PCINT2)) ; port RadFET.Enable
RadFET_~{FAULT}_3V3: AVR_U1.34(PA3_(ADC3/PCINT3)) MCU_R17.1
RadFET_~{FAULT}_5V: AVR_U1.36(PA1_(ADC1/PCINT1)) MCU_R16.1
RadFET_MISO: AVR_U1.31(PA6_(ADC6/PCINT6)) ; harness SPI.MISO
RadFET_MOSI: AVR_U1.30(PA7_(ADC7/PCINT7)) ; harness SPI.MOSI
RadFET_MUX_A0: AVR_U1.14(PD5_(PCINT29/OC1A)) ; harness ADG709_MUX.A0
RadFET_MUX_A1: AVR_U1.15(PD6_(PCINT30/OC2B/ICP)) ; harness ADG709_MUX.A1
RadFET_MUX_EN: AVR_U1.13(PD4_(PCINT28/XCK1/OC1B)) ; harness ADG709_MUX.EN
RadFET_SCK: AVR_U1.26(PC7_(TOSC2/PCINT23)) ; harness SPI.SCK
RadFET_Temp_MUX: AVR_U1.25(PC6_(TOSC1/PCINT22)) ; port RadFET.Temp_MUX
RXD1: AVR_U1.11(PD2_(PCINT/RXD1/26/INT0)) MCU_R14.1 MCU_R18.2
SCK: AVR_U1.3(PB7_(PCINT15/SCK)) MCU_R4.2 ; harness SPI.SCK
SCL: AVR_U1.19(PC0_(PCINT16/SCL)) ; port I2C.SCL
SDA: AVR_U1.20(PC1_(PCINT17/SDA)) ; port I2C.SDA
TCK: AVR_P1.1 AVR_U1.21(PC2_(PCINT18/TCK)) MCU_R9.2
TDI: AVR_P1.9 AVR_U1.24(PC5_(TDI/PCINT21)) MCU_R12.2
TDO: AVR_P1.3 AVR_U1.23(PC4_(TDO/PCINT20)) MCU_R10.2
TMS: AVR_P1.5 AVR_U1.22(PC3_(PCINT19/TMS)) MCU_R11.2
TXD1: AVR_U1.12(PD3_(PCINT/TXD1/27/INT1)) MCU_R15.1 MCU_R19.2
WDG: AVR_U1.44(PB4_(~{SS}/OC0B/PCINT12)) ; sheet Watchdog/INPUT
NetMCU_R14_2: MCU_R14.2 P1.3
NetMCU_R15_2: MCU_R15.2 P1.2
NetMCU_R16_2: MCU_R16.2 ; port RadFET.~{FAULT}_5V
NetMCU_R17_2: MCU_R17.2 ; port RadFET.~{FAULT}_3V3

Not connected (* = marked no-connect by the designer): AVR_P1 7 8; AVR_U1 7(XTAL2) 8(XTAL1) 16(PD7_(PCINT31/OC2A)) 37(PA0_(ADC0/PCINT0))

### Layout directives
net class I2C_PLD: SCL, SDA

### Notes on the sheet
- Title:
- Project:
- Author:
- Model:
- Document Number:
- Checked by:
- Rev:
- Date:
- Approved by:
- Sheet:
- of
- File name:

### Library data of the parts
AVR_C1-AVR_C4 AVR_C6 = Cer_C0603T104K5RALTU: Ceramic Cap Kemet COTS 100n/50V X7R 0603; Manufacturer: Kemet; ManufacturerPartNumber: C0603T104K5RALTU; Value: 100n/50V
AVR_P1 = Header 5X2: Header, 5-Pin, Dual row; LatestRevisionDate: 17-Jul-2002; LatestRevisionNote: Re-released for DXP Platform.; Publisher: Altium Limited
AVR_U1 = ATMEGA164PV-10AQ: General-purpose microcontroller; Value: ATMEGA164PV-10AQ
MCU_R1-MCU_R19 = Res: Package: 0603
  MCU_R1-MCU_R13 MCU_R18 MCU_R19: Value: 10k
  MCU_R14-MCU_R17: Value: 100R
P1 = Header 3: Header, 3-Pin; LatestRevisionDate: 17-Jul-2002; LatestRevisionNote: Re-released for DXP Platform.; Publisher: Altium Limited
R1 = CRCW060310K0FKxxxx: 10k/1% Vishay CRCW 0603 Resistor. 100mW, 100ppm, 75V.; Manufacturer: Vishay; ManufacturerPartNumber: CRCW060310K0FKxxxx; Value: 10k/1%

## Sheet PLD_AVR_Watchdog.SchDoc: Watchdog for RadFET
size A4; ApprovedBy: Piotr Kuligowski; CheckedBy: Michal Gumiela; Author: Grzegorz Gajoch; DocumentNumber: PWSat2-xxx-DW-xxx; Revision: 1; SheetTotal: 32; Model: DM1
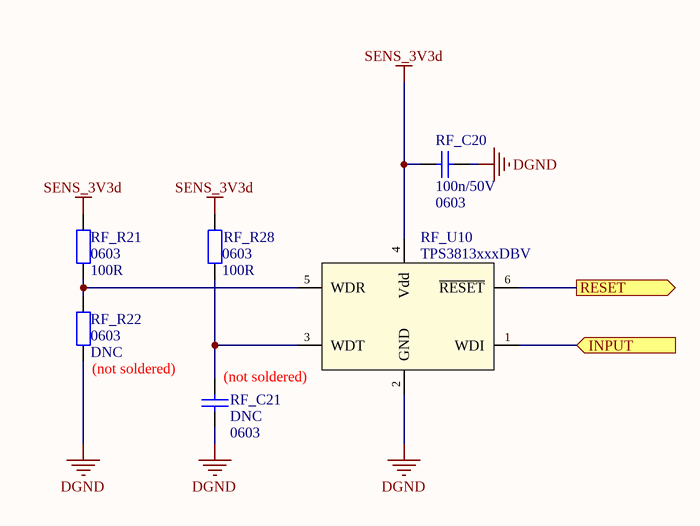
[diagram p10: PLD_AVR_Watchdog.SchDoc]

### Parts
RF_C20  Package: 0603  [SMD_Capacitor_0603]  (hidden comment: 100n/50V)
RF_C21  Package: 0603  [SMD_Capacitor_0603]  (hidden comment: DNC)
RF_R21  0603  value 100R  [SMD_Resistor_0603]
RF_R22  0603  value DNC  [SMD_Resistor_0603]
RF_R28  0603  value 100R  [SMD_Resistor_0603]
RF_U10  TPS3813xxxDBV  [SOT23-6]

### Ports
INPUT (in), RESET (out)

### Nets
DGND: RF_C20.2 RF_C21.2 RF_R22.1 RF_U10.2(GND)
SENS_3V3d: RF_C20.1 RF_R21.2 RF_R28.2 RF_U10.4(Vdd)
~{RST}: RF_U10.6(~{RESET}) ; port RESET
WDG: RF_U10.1(WDI) ; port INPUT
NetRF_C21_1: RF_C21.1 RF_R28.1 RF_U10.3(WDT)
NetRF_R21_1: RF_R21.1 RF_R22.2 RF_U10.5(WDR)

### Notes on the sheet
- (not soldered)
- (near RF_U10) (not soldered)
- Title:
- Project:
- Author:
- Model:
- Document Number:
- Checked by:
- Rev:
- Date:
- Approved by:
- Sheet:
- of
- File name:

### Library data of the parts
RF_C20 RF_C21 = Cer_C0603T104K5RALTU: Ceramic Cap Kemet COTS 100n/50V X7R 0603; Manufacturer: Kemet; ManufacturerPartNumber: C0603T104K5RALTU
  RF_C20: Value: 100n/50V
  RF_C21: Value: DNC
RF_R21 RF_R22 RF_R28 = Res2: Resistor; Published: 8-Jun-2000; LatestRevisionDate: 17-Jul-2002; LatestRevisionNote: Re-released for DXP Platform.; PackageReference: AXIAL-0.4; Publisher: Altium Limited; PackageDescription: Axial Device, Thru-Hole; 2 Leads; 0.4 in Pin Spacing
RF_U10 = TPS3813xxxDBV: Processor Supervisory Circuits with Window-Watchdog.; Manufacturer: Texas Instruments; Value: TPS3813xxxDBV

## Sheet PLD_CAM_MUX.SchDoc: CAMs UART-Buffer
size A4; ApprovedBy: Piotr Kuligowski; CheckedBy: Michal Gumiela; Author: Grzegorz Gajoch; DocumentNumber: PWSat2-xxx-DW-xxx; Revision: 1; SheetTotal: 32; Model: DM1
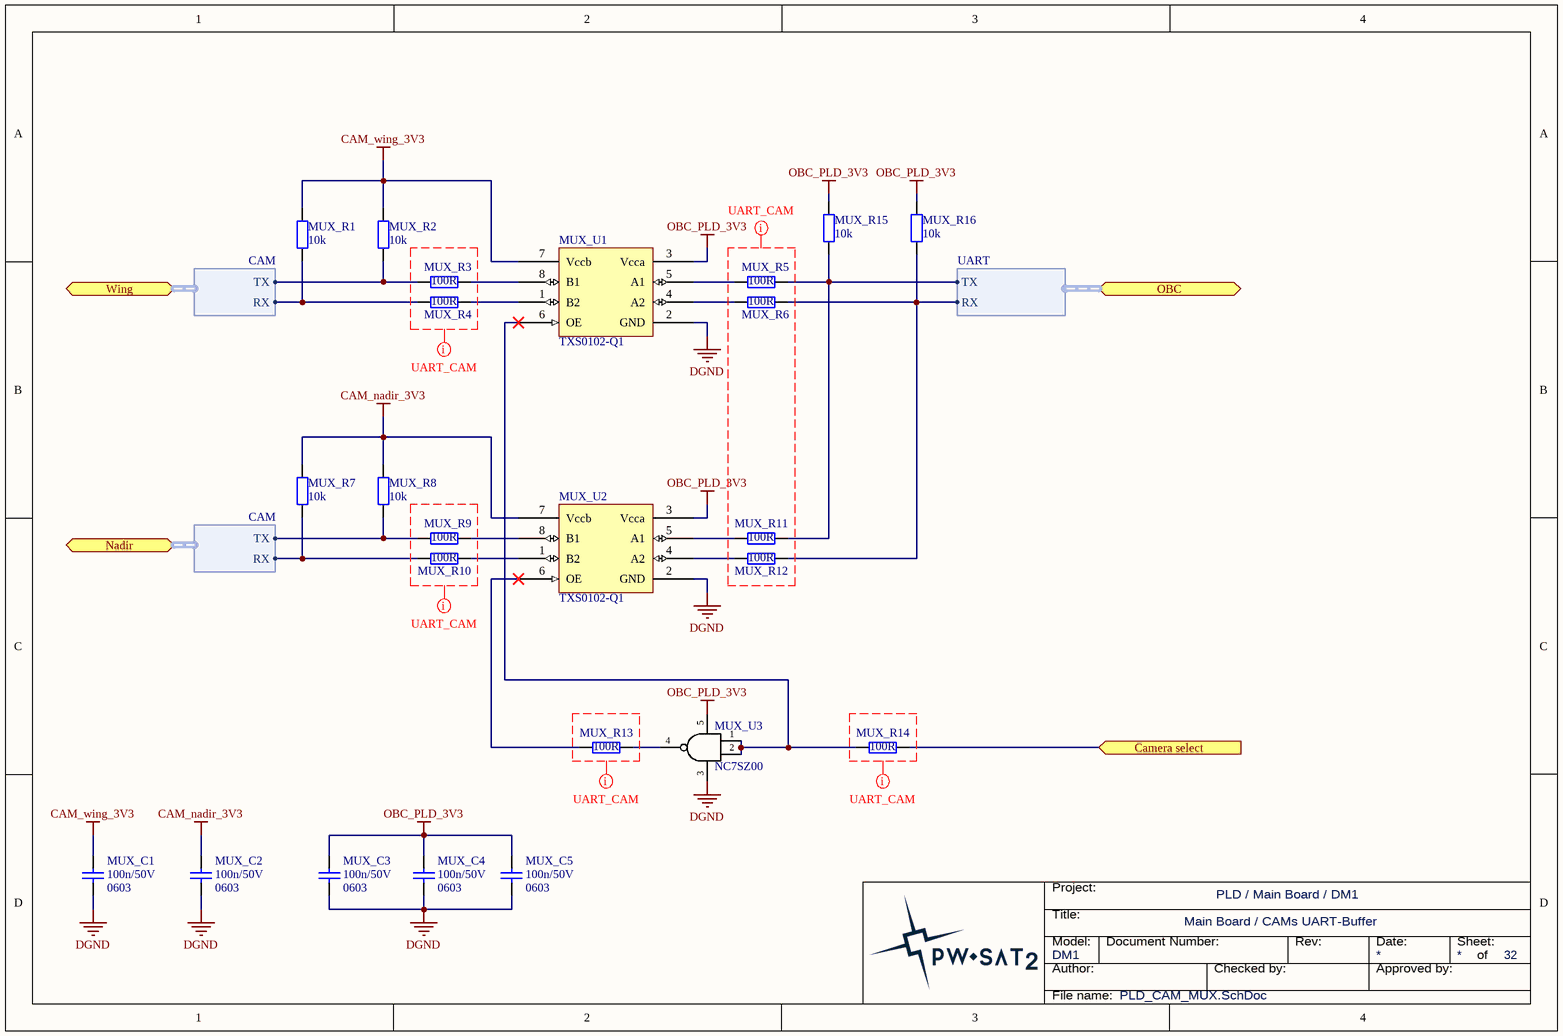
[diagram p11: PLD_CAM_MUX.SchDoc]

### Parts
MUX_C1  Package: 0603  [SMD_Capacitor_0603]  (hidden comment: 100n/50V)
MUX_C2  Package: 0603  [SMD_Capacitor_0603]  (hidden comment: 100n/50V)
MUX_C3  Package: 0603  [SMD_Capacitor_0603]  (hidden comment: 100n/50V)
MUX_C4  Package: 0603  [SMD_Capacitor_0603]  (hidden comment: 100n/50V)
MUX_C5  Package: 0603  [SMD_Capacitor_0603]  (hidden comment: 100n/50V)
MUX_R1  10k  [SMD_Resistor_0603]
MUX_R2  10k  [SMD_Resistor_0603]
MUX_R3  100R  [SMD_Resistor_0603]
MUX_R4  100R  [SMD_Resistor_0603]
MUX_R5  100R  [SMD_Resistor_0603]
MUX_R6  100R  [SMD_Resistor_0603]
MUX_R7  10k  [SMD_Resistor_0603]
MUX_R8  10k  [SMD_Resistor_0603]
MUX_R9  100R  [SMD_Resistor_0603]
MUX_R10  100R  [SMD_Resistor_0603]
MUX_R11  100R  [SMD_Resistor_0603]
MUX_R12  100R  [SMD_Resistor_0603]
MUX_R13  100R  [SMD_Resistor_0603]
MUX_R14  100R  [SMD_Resistor_0603]
MUX_R15  10k  [SMD_Resistor_0603]
MUX_R16  10k  [SMD_Resistor_0603]
MUX_U1  TXS0102-Q1  [VSSOP-8]
MUX_U2  TXS0102-Q1  [VSSOP-8]
MUX_U3  NC7SZ00  [SOT23-5]

### Ports
Camera select (in), Nadir (harness CAM), OBC (harness UART), Wing (harness CAM)

### Harnesses
UART: RX, TX
CAM: TX, RX

### Nets
CAM_nadir_3V3: MUX_C2.1 MUX_R7.1 MUX_R8.1 MUX_U2.7(Vccb)
CAM_wing_3V3: MUX_C1.1 MUX_R1.2 MUX_R2.2 MUX_U1.7(Vccb)
DGND: MUX_C1.2 MUX_C2.2 MUX_C3.2 MUX_C4.2 MUX_C5.2 MUX_U1.2(GND) MUX_U2.2(GND) MUX_U3.3(GND)
OBC_PLD_3V3: MUX_C3.1 MUX_C4.1 MUX_C5.1 MUX_R15.2 MUX_R16.2 MUX_U1.3(Vcca) MUX_U2.3(Vcca) MUX_U3.5(Vcc)
Piggyback_GPIO_PB12: MUX_R14.2 ; port Camera select
Piggyback_UART-RX_PF7: MUX_R6.1 MUX_R12.2 MUX_R16.1 ; port OBC.RX
Piggyback_UART-TX_PF6: MUX_R5.1 MUX_R11.2 MUX_R15.1 ; port OBC.TX
NetCONN_H3_1: MUX_R1.1 MUX_R4.2 ; port Wing.RX
NetCONN_H3_4: MUX_R2.1 MUX_R3.2 ; port Wing.TX
NetCONN_H5_1: MUX_R7.2 MUX_R10.1 ; port Nadir.RX
NetCONN_H5_4: MUX_R8.2 MUX_R9.1 ; port Nadir.TX
NetMUX_R3_1: MUX_R3.1 MUX_U1.8(B1)
NetMUX_R4_1: MUX_R4.1 MUX_U1.1(B2)
NetMUX_R5_2: MUX_R5.2 MUX_U1.5(A1)
NetMUX_R6_2: MUX_R6.2 MUX_U1.4(A2)
NetMUX_R9_2: MUX_R9.2 MUX_U2.8(B1)
NetMUX_R10_2: MUX_R10.2 MUX_U2.1(B2)
NetMUX_R11_1: MUX_R11.1 MUX_U2.5(A1)
NetMUX_R12_1: MUX_R12.1 MUX_U2.4(A2)
NetMUX_R13_1: MUX_R13.1 MUX_U2.6(OE)
NetMUX_R13_2: MUX_R13.2 MUX_U3.4(Y)
NetMUX_R14_1: MUX_R14.1 MUX_U1.6(OE) MUX_U3.1(A) MUX_U3.2(B)

### Layout directives
net class UART_CAM: (no net found under the mark)

### Notes on the sheet
- Title:
- Project:
- Author:
- Model:
- Document Number:
- Checked by:
- Rev:
- Date:
- Approved by:
- Sheet:
- of
- File name:

### Library data of the parts
MUX_C1-MUX_C5 = Cer_C0603T104K5RALTU: Ceramic Cap Kemet COTS 100n/50V X7R 0603; Manufacturer: Kemet; ManufacturerPartNumber: C0603T104K5RALTU; Value: 100n/50V
MUX_R1-MUX_R16 = Res
  MUX_R1 MUX_R2: Value: 10k; Package: 0603
  MUX_R3-MUX_R6 MUX_R9-MUX_R14: Value: 100R
  MUX_R7 MUX_R8 MUX_R15 MUX_R16: Value: 10k
MUX_U1 MUX_U2 = TXS0102-Q1: 2-Bit Bidirectional Voltage-Level Translator  for Open-Drain and Push-Pull Applications; Manufacturer: Texas Instruments; Value: TXS0102-Q1; ComponentLink1URL: http://www.ti.com/lit/ds/symlink/txs0102-q1.pdf; ComponentLink1Description: Description; HelpURL: http://www.ti.com/lit/ds/symlink/txs0102-q1.pdf
MUX_U3 = NC7SZ00: TinyLogic UHS Two-Input NAND Gate.; Manufacturer: Fairchild Semiconductor; Value: NC7SZ00

## Sheet PLD_SunSref-Interface.SchDoc: SunS Ref. Interface
size A4; ApprovedBy: Piotr Kuligowski; CheckedBy: Michal Gumiela; Author: Grzegorz Gajoch; DocumentNumber: PWSat2-xxx-DW-xxx; Revision: 1; SheetTotal: 32; Model: DM1
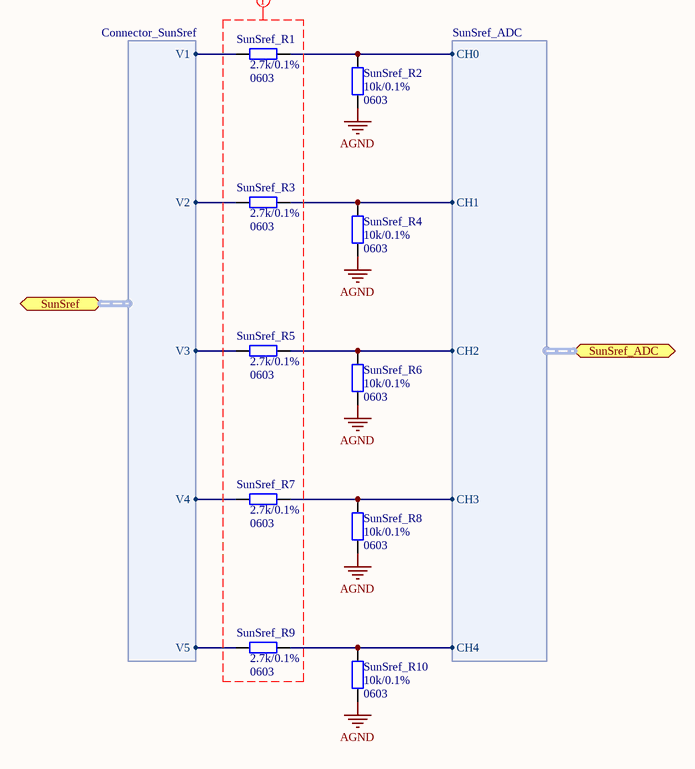
[diagram p12: PLD_SunSref-Interface.SchDoc]

### Parts
SunSref_R1  Package: 0603  [SMD_Resistor_0603]  (hidden comment: 2.7k/0.1%)
SunSref_R2  Package: 0603  [SMD_Resistor_0603]  (hidden comment: 10k/0.1%)
SunSref_R3  Package: 0603  [SMD_Resistor_0603]  (hidden comment: 2.7k/0.1%)
SunSref_R4  Package: 0603  [SMD_Resistor_0603]  (hidden comment: 10k/0.1%)
SunSref_R5  Package: 0603  [SMD_Resistor_0603]  (hidden comment: 2.7k/0.1%)
SunSref_R6  Package: 0603  [SMD_Resistor_0603]  (hidden comment: 10k/0.1%)
SunSref_R7  Package: 0603  [SMD_Resistor_0603]  (hidden comment: 2.7k/0.1%)
SunSref_R8  Package: 0603  [SMD_Resistor_0603]  (hidden comment: 10k/0.1%)
SunSref_R9  Package: 0603  [SMD_Resistor_0603]  (hidden comment: 2.7k/0.1%)
SunSref_R10  Package: 0603  [SMD_Resistor_0603]  (hidden comment: 10k/0.1%)

### Ports
SunSref (harness Connector_SunSref), SunSref_ADC (harness SunSref_ADC)

### Harnesses
Connector_SunSref: V1, V2, V3, V4, V5
SunSref_ADC: CH0, CH1, CH2, CH3, CH4

### Nets
AGND: SunSref_R2.1 SunSref_R4.1 SunSref_R6.1 SunSref_R8.1 SunSref_R10.1
NetADC_C1_1: SunSref_R1.2 SunSref_R2.2 ; port SunSref_ADC.CH0
NetADC_C2_1: SunSref_R9.2 SunSref_R10.2 ; port SunSref_ADC.CH4
NetADC_C3_1: SunSref_R3.2 SunSref_R4.2 ; port SunSref_ADC.CH1
NetADC_C4_1: SunSref_R7.2 SunSref_R8.2 ; port SunSref_ADC.CH3
NetADC_C6_1: SunSref_R5.2 SunSref_R6.2 ; port SunSref_ADC.CH2
NetCONN_H1_1: SunSref_R7.1 ; port SunSref.V4
NetCONN_H1_2: SunSref_R5.1 ; port SunSref.V3
NetCONN_H1_4: SunSref_R1.1 ; port SunSref.V1
NetCONN_H1_6: SunSref_R3.1 ; port SunSref.V2
NetCONN_H1_7: SunSref_R9.1 ; port SunSref.V5

### Layout directives
net class SunS-ref: (no net found under the mark)

### Notes on the sheet
- Title:
- Project:
- Author:
- Model:
- Document Number:
- Checked by:
- Rev:
- Date:
- Approved by:
- Sheet:
- of
- File name:

### Library data of the parts
SunSref_R1-SunSref_R10 = Res
  SunSref_R1 SunSref_R3 SunSref_R5 SunSref_R7 SunSref_R9: Value: 2.7k/0.1%
  SunSref_R2 SunSref_R4 SunSref_R6 SunSref_R8 SunSref_R10: Value: 10k/0.1%

## Sheet PLD_ADC.SchDoc: ADC for SunSref,Photodiodes and HK
size A4; ApprovedBy: Piotr Kuligowski; CheckedBy: Michal Gumiela; Author: Grzegorz Gajoch; DocumentNumber: PWSat2-xxx-DW-xxx; Revision: 1; SheetTotal: 32; Model: DM1
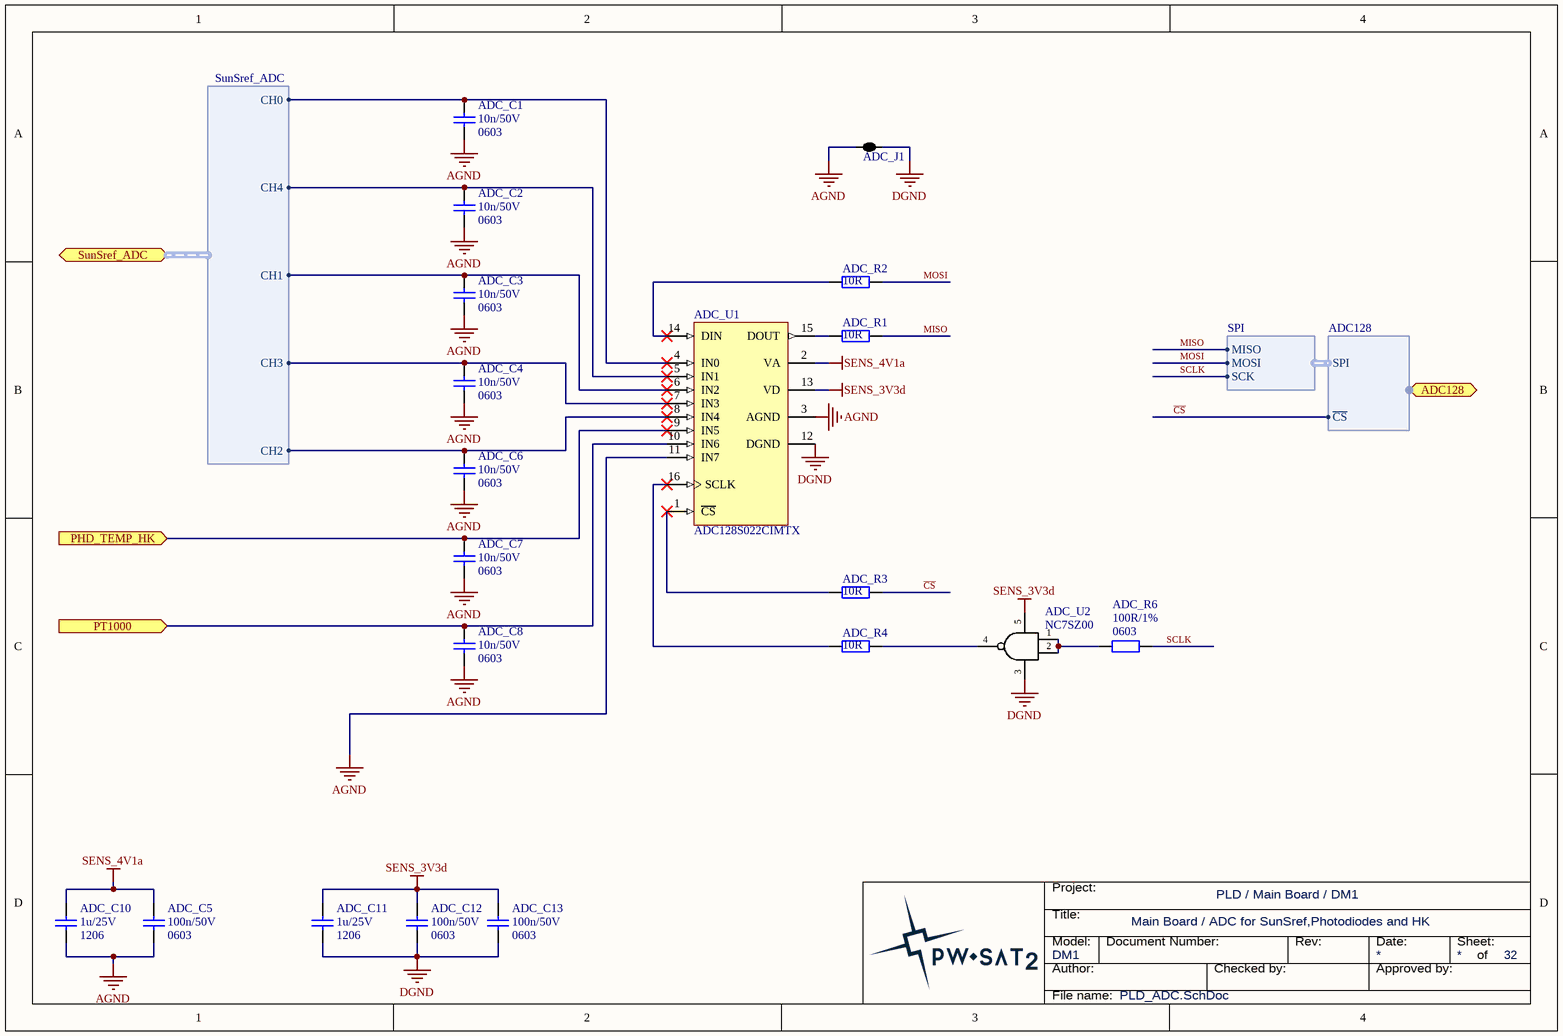
[diagram p13: PLD_ADC.SchDoc]

### Parts
ADC_C1  value 10n/50V  Package: 0603  [SMD_Capacitor_0603]  (hidden comment: Cap)
ADC_C2  value 10n/50V  Package: 0603  [SMD_Capacitor_0603]  (hidden comment: Cap)
ADC_C3  value 10n/50V  Package: 0603  [SMD_Capacitor_0603]  (hidden comment: Cap)
ADC_C4  value 10n/50V  Package: 0603  [SMD_Capacitor_0603]  (hidden comment: Cap)
ADC_C5  Package: 0603  [SMD_Capacitor_0603]  (hidden comment: 100n/50V)
ADC_C6  value 10n/50V  Package: 0603  [SMD_Capacitor_0603]  (hidden comment: Cap)
ADC_C7  value 10n/50V  Package: 0603  [SMD_Capacitor_0603]  (hidden comment: Cap)
ADC_C8  value 10n/50V  Package: 0603  [SMD_Capacitor_0603]  (hidden comment: Cap)
ADC_C10  Package: 1206  [SMD_Capacitor_1206]  (hidden comment: 1u/25V)
ADC_C11  Package: 1206  [SMD_Capacitor_1206]  (hidden comment: 1u/25V)
ADC_C12  Package: 0603  [SMD_Capacitor_0603]  (hidden comment: 100n/50V)
ADC_C13  Package: 0603  [SMD_Capacitor_0603]  (hidden comment: 100n/50V)
ADC_J1  2 way net tie junction  [2way_LP]  (value not drawn)  (net tie, no BOM)
ADC_R1  10R  [SMD_Resistor_0603]
ADC_R2  10R  [SMD_Resistor_0603]
ADC_R3  10R  [SMD_Resistor_0603]
ADC_R4  10R  [SMD_Resistor_0603]
ADC_R6  Package: 0603  [SMD_Resistor_0603]  (hidden comment: 100R/1%)
ADC_U1  ADC128S022CIMTX  [TSSOP16]
ADC_U2  NC7SZ00  [SOT23-5]

### Ports
ADC128 (harness ADC128), PHD_TEMP_HK (in), PT1000 (in), SunSref_ADC (harness SunSref_ADC)

### Harnesses
SPI: MISO, MOSI, SCK
SunSref_ADC: CH0, CH1, CH2, CH3, CH4
ADC128: SPI, ~{CS}

### Nets
AGND: ADC_C1.2 ADC_C2.2 ADC_C3.2 ADC_C4.2 ADC_C5.2 ADC_C6.2 ADC_C7.2 ADC_C8.2 ADC_C10.2 ADC_J1.1 ADC_U1.3(AGND) ADC_U1.11(IN7)
DGND: ADC_C11.2 ADC_C12.2 ADC_C13.2 ADC_J1.2 ADC_U1.12(DGND) ADC_U2.3(GND)
SENS_3V3d: ADC_C11.1 ADC_C12.1 ADC_C13.1 ADC_U1.13(VD) ADC_U2.5(Vcc)
SENS_4V1a: ADC_C5.1 ADC_C10.1 ADC_U1.2(VA)
~{CS}: ADC_R3.2 ; port ADC128.~{CS}  [project net ADC128_~{CS}]
MISO: ADC_R1.2 ; harness SPI.MISO
MOSI: ADC_R2.2 ; harness SPI.MOSI
SCLK: ADC_R6.2 ; harness SPI.SCK  [project net SCK]
NetADC_C1_1: ADC_C1.1 ADC_U1.4(IN0) ; port SunSref_ADC.CH0
NetADC_C2_1: ADC_C2.1 ADC_U1.5(IN1) ; port SunSref_ADC.CH4
NetADC_C3_1: ADC_C3.1 ADC_U1.6(IN2) ; port SunSref_ADC.CH1
NetADC_C4_1: ADC_C4.1 ADC_U1.7(IN3) ; port SunSref_ADC.CH3
NetADC_C6_1: ADC_C6.1 ADC_U1.8(IN4) ; port SunSref_ADC.CH2
NetADC_C7_1: ADC_C7.1 ADC_U1.9(IN5) ; port PHD_TEMP_HK
NetADC_C8_1: ADC_C8.1 ADC_U1.10(IN6) ; port PT1000
NetADC_R1_1: ADC_R1.1 ADC_U1.15(DOUT)
NetADC_R2_1: ADC_R2.1 ADC_U1.14(DIN)
NetADC_R3_1: ADC_R3.1 ADC_U1.1(~{CS})
NetADC_R4_1: ADC_R4.1 ADC_U1.16(SCLK)
NetADC_R4_2: ADC_R4.2 ADC_U2.4(Y)
NetADC_R6_1: ADC_R6.1 ADC_U2.1(A) ADC_U2.2(B)

### Notes on the sheet
- Title:
- Project:
- Author:
- Model:
- Document Number:
- Checked by:
- Rev:
- Date:
- Approved by:
- Sheet:
- of
- File name:

### Library data of the parts
ADC_C5 ADC_C12 ADC_C13 = Cer_C0603T104K5RALTU: Ceramic Cap Kemet COTS 100n/50V X7R 0603; Manufacturer: Kemet; ManufacturerPartNumber: C0603T104K5RALTU; Value: 100n/50V
ADC_C10 ADC_C11 = Cer_C1206T105K3RALTU: Ceramic Cap Kemet COTS 1u/25V X7R 1206; ManufacturerPartNumber: C1206T105K3RALTU; Manufacturer: Kemet; Value: 1u/25V
ADC_J1 = 2way: ComponentLink1URL: http://www.edatools.cz/addons; ComponentLink1Description: Source; FootprintNote: LP=12mil, MP=40mil, HP=120mil
ADC_R1-ADC_R4 = Res: Value: 10R; Package: 0603
ADC_R6 = CRCW0603100RFKxxxx: 100R/1% Vishay CRCW 0603 Resistor. 100mW, 100ppm, 75V.; Manufacturer: Vishay; ManufacturerPartNumber: CRCW0603100RFKxxxx; Value: 100R/1%
ADC_U1 = ADC128S022CIMTX: ADC128S022 8-Channel, 50 kSPS to 200 kSPS, 12-Bit A/D Converter; Manufacturer: Texas Instruments; Category: ADC; ManufacturerPartNumber: ADC128S022CIMTX
ADC_U2 = NC7SZ00: as MUX_U3 on sheet PLD_CAM_MUX; Value: NC7SZ00

## Sheet PLD_Gyroscopes.SchDoc: Gyroscopes
size A4; ApprovedBy: Piotr Kuligowski; CheckedBy: Michal Gumiela; Author: Grzegorz Gajoch; DocumentNumber: PWSat2-xxx-DW-xxx; Revision: 1; SheetTotal: 32; Model: DM1
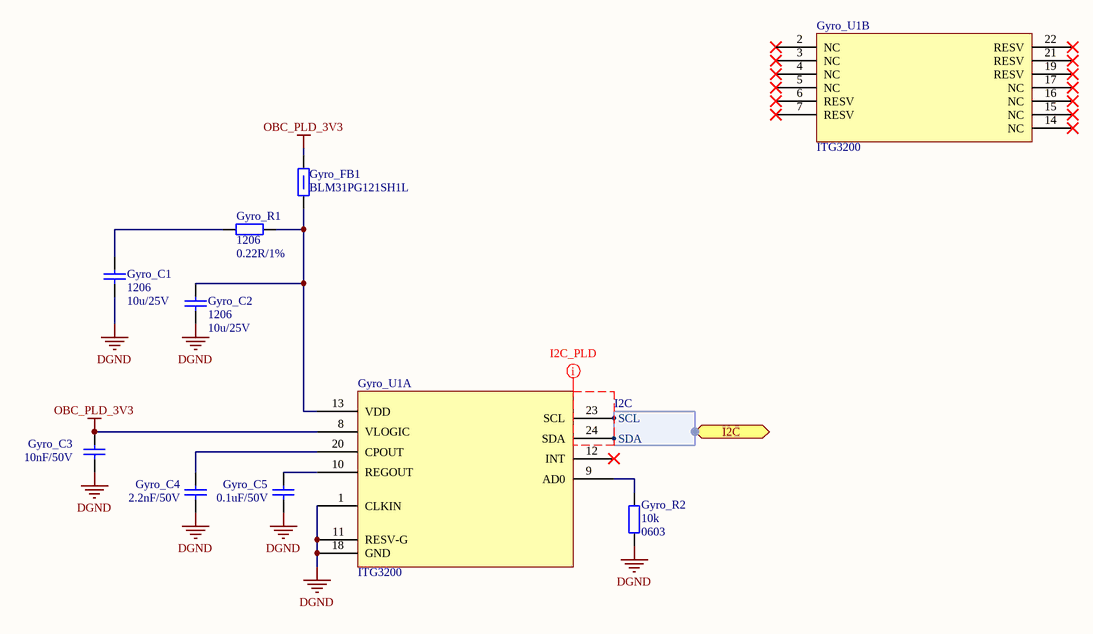
[diagram p14: PLD_Gyroscopes.SchDoc]

### Parts
Gyro_C1  Package: 1206  [SMD_Capacitor_1206]  (hidden comment: 10u/25V)
Gyro_C2  Package: 1206  [SMD_Capacitor_1206]  (hidden comment: 10u/25V)
Gyro_C3  10nF/50V  [SMD_Capacitor_0603]
Gyro_C4  2.2nF/50V  [SMD_Capacitor_0603]
Gyro_C5  0.1uF/50V  [SMD_Capacitor_0603]
Gyro_FB1  120R/100MHz  [SMD_FerriteBead_1206]  (value not drawn)
Gyro_R1  Package: 1206  [SMD_Resistor_1206]  (hidden comment: 0.22R/1%)
Gyro_R2  10k  Package: 0603  [SMD_Resistor_0603]
Gyro_U1  ITG3200  [QFN24_4x4]  (parts A,B of 2)

### Ports
I2C (harness I2C)

### Harnesses
I2C: SDA, SCL

### Nets
DGND: Gyro_C1.2 Gyro_C2.2 Gyro_C3.2 Gyro_C4.2 Gyro_C5.2 Gyro_R2.2 Gyro_U1.1(CLKIN) Gyro_U1.11(RESV-G) Gyro_U1.18(GND)
OBC_PLD_3V3: Gyro_C3.1 Gyro_FB1.1 Gyro_U1.8(VLOGIC)
NetGyro_C1_1: Gyro_C1.1 Gyro_R1.1
NetGyro_C2_1: Gyro_C2.1 Gyro_FB1.2 Gyro_R1.2 Gyro_U1.13(VDD)
NetGyro_C4_1: Gyro_C4.1 Gyro_U1.20(CPOUT)
NetGyro_C5_1: Gyro_C5.1 Gyro_U1.10(REGOUT)
NetGyro_R2_1: Gyro_R2.1 Gyro_U1.9(AD0)
NetGyro_U1_23: Gyro_U1.23(SCL) ; port I2C.SCL
NetGyro_U1_24: Gyro_U1.24(SDA) ; port I2C.SDA

Not connected (* = marked no-connect by the designer): Gyro_U1 2(NC)* 3(NC)* 4(NC)* 5(NC)* 6(RESV)* 7(RESV)* 12(INT)* 14(NC)* 15(NC)* 16(NC)* 17(NC)* 19(RESV)* 21(RESV)* 22(RESV)*

### Layout directives
net class I2C_PLD: (no net found under the mark)

### Notes on the sheet
- Title:
- Project:
- Author:
- Model:
- Document Number:
- Checked by:
- Rev:
- Date:
- Approved by:
- Sheet:
- of
- File name:

### Library data of the parts
Gyro_C1 Gyro_C2 = Cer_C1206T105K3RALTU: Ceramic Cap Kemet COTS 1u/25V X7R 1206; ManufacturerPartNumber: C1206T105K3RALTU; Manufacturer: Kemet; Value: 10u/25V
Gyro_C3-Gyro_C5 = Cer_C0603T104K5RALTU: Ceramic Cap Kemet COTS 100n/50V X7R 0603; Manufacturer: Kemet; ManufacturerPartNumber: C0603T104K5RALTU; Package: 0603
  Gyro_C3: Value: 10nF/50V
  Gyro_C4: Value: 2.2nF/50V
  Gyro_C5: Value: 0.1uF/50V
Gyro_FB1 = BLM31PG121SH1L: Ferrite bead, 1206, 0.02HM, 3.5A.; Manufacturer: Murata; Current Rating: 3.5A; Series Resistance DC: 0.02R; Package: 1206; Value: 120R/100MHz; ManufacturerPartNumber: BLM31PG121SH1L
Gyro_R1 = ERJ-8BQFR22V: Panasonic Resistor 0.22R 1% 1206 330mW; Manufacturer: Panasonic; ManufacturerPartNumber: ERJ-8BQFR22V; Value: 0.22R/1%
Gyro_R2 = Res: Value: 10k

## Sheet PLD_Flash-Memory.SchDoc: Flash Memory
size A4; ApprovedBy: Piotr Kuligowski; CheckedBy: Michal Gumiela; Author: Grzegorz Gajoch; DocumentNumber: PWSat2-xxx-DW-xxx; Revision: 1; SheetTotal: 32; Model: DM1
Used 3 times, as channels PLD Top/Flash Memory 3, PLD Top/Flash Memory 2, PLD Top/Flash Memory 1. Parts and nets are listed once, with the designators drawn on the sheet.
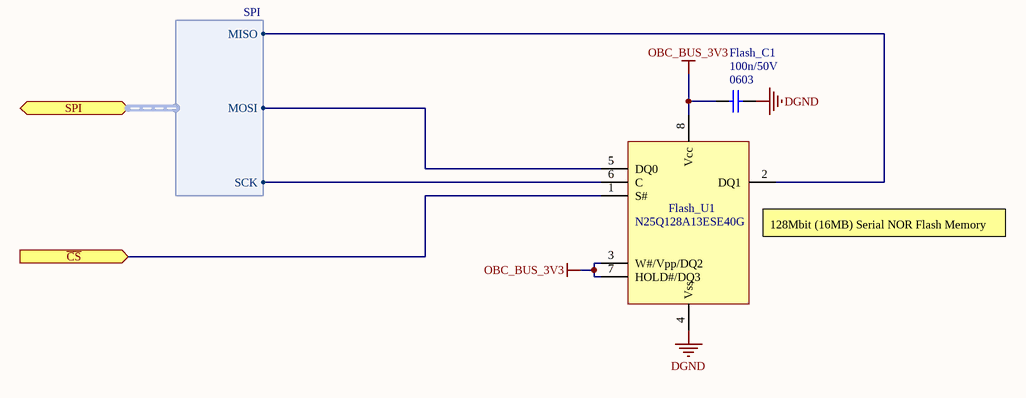
[diagram p15: PLD_Flash-Memory.SchDoc]

### Parts
Flash_C1  Package: 0603  [SMD_Capacitor_0603]  (hidden comment: 100n/50V)
Flash_U1  (no value)  [SOIC-8-W]

### Ports
SPI (harness SPI), ~{CS} (in)

### Harnesses
SPI: MISO, MOSI, SCK

### Nets
DGND: Flash_C1.1 Flash_U1.4(Vss)
OBC_BUS_3V3: Flash_C1.2 Flash_U1.3(W#/Vpp/DQ2) Flash_U1.7(HOLD#/DQ3) Flash_U1.8(Vcc)
~{CS}: Flash_U1.1(S#) ; port ~{CS}
NetFlash_U1_2: Flash_U1.2(DQ1) ; port SPI.MISO
NetFlash_U1_5: Flash_U1.5(DQ0) ; port SPI.MOSI
NetFlash_U1_6: Flash_U1.6(C) ; port SPI.SCK

### Channels
PLD Top/Flash Memory 3: designators end in _Flash_Memory_3; ports ~{CS}=NetFlash_U1_Flash_Memory_3_1
PLD Top/Flash Memory 2: designators end in _Flash_Memory_2; ports ~{CS}=NetFlash_U1_Flash_Memory_2_1
PLD Top/Flash Memory 1: designators end in _Flash_Memory_1; ports ~{CS}=NetFlash_U1_Flash_Memory_1_1

### Notes on the sheet
- (near Flash_U1) 128Mbit (16MB) Serial NOR Flash Memory
- Title:
- Project:
- Author:
- Model:
- Document Number:
- Checked by:
- Rev:
- Date:
- Approved by:
- Sheet:
- of
- File name:

### Library data of the parts
Flash_C1 = Cer_C0603T104K5RALTU: Ceramic Cap Kemet COTS 100n/50V X7R 0603; Manufacturer: Kemet; ManufacturerPartNumber: C0603T104K5RALTU; Value: 100n/50V
Flash_U1 = N25Q128A13ESE40G: 128Mbit, 3V Serial NOR Flash Memory; Manufacturer: Micron; ManufacturerPartNumber: N25Q128A13ESE40G